# Altium project WUT-4-3-3.PrjPCB (part 1 of 2)
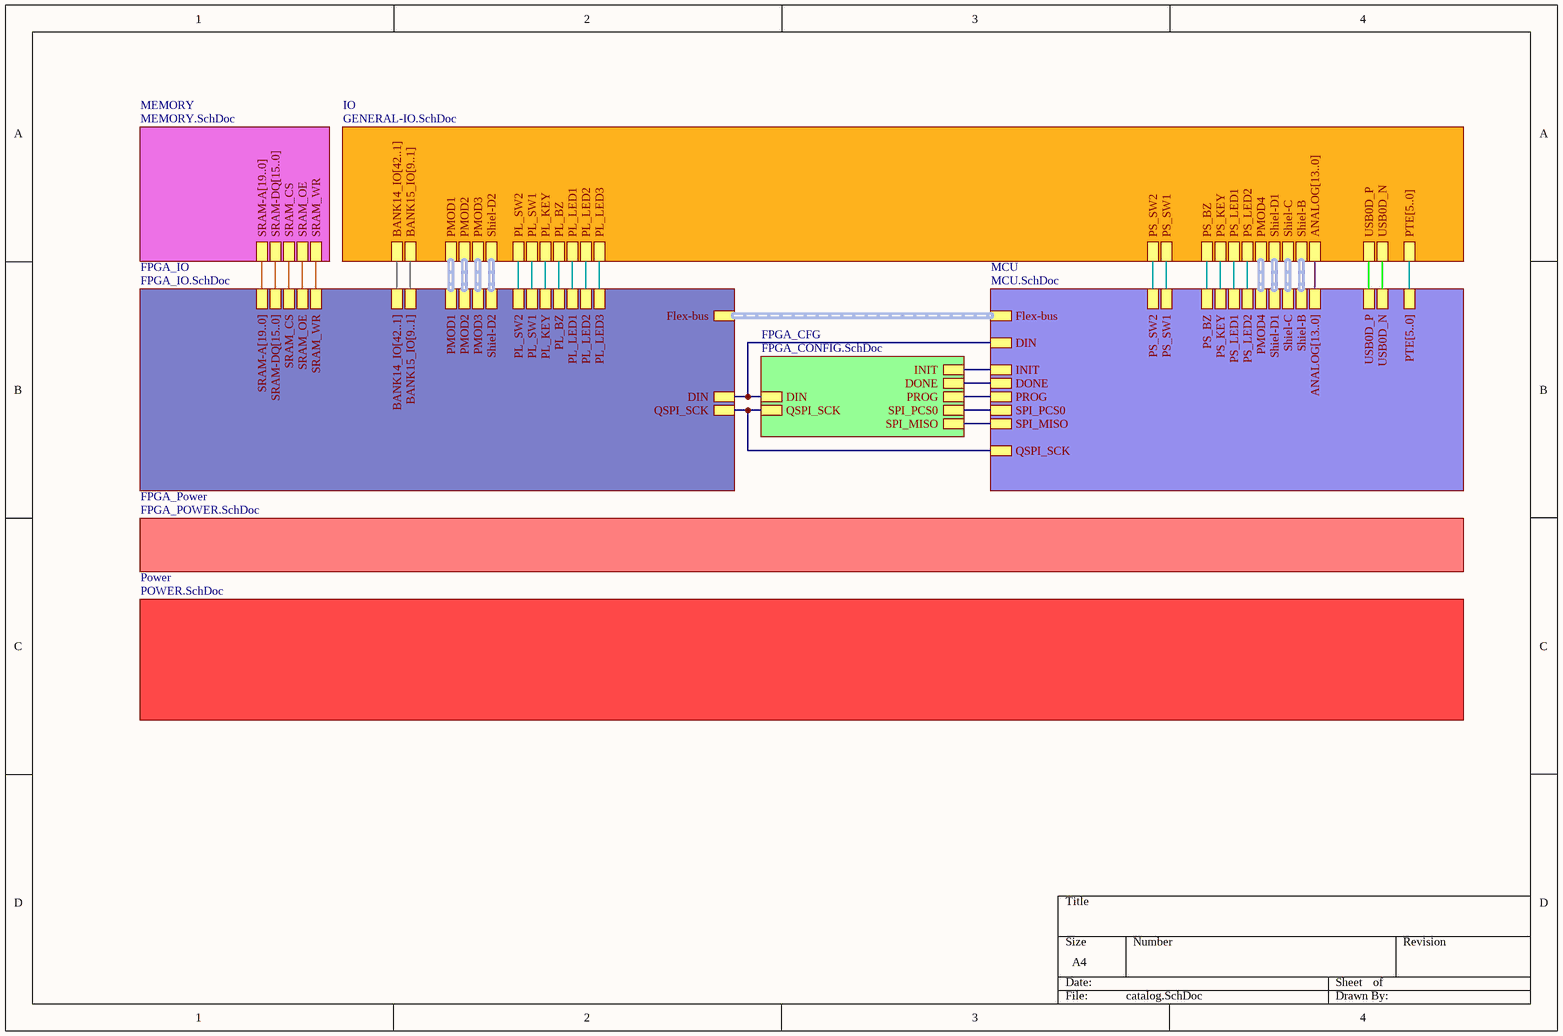
[diagram p0: catalog.SchDoc]
8 sheets, 240 parts. Net scope: hierarchical (ports join the sheet entries above them; power ports are global).
Board file: WUT-4-3-3.PcbDoc
Sheets:
  catalog.SchDoc
    FPGA_IO = FPGA_IO.SchDoc
    Power = POWER.SchDoc
    IO = GENERAL-IO.SchDoc
    MEMORY = MEMORY.SchDoc
    FPGA_CFG = FPGA_CONFIG.SchDoc
    FPGA_Power = FPGA_POWER.SchDoc
    MCU = MCU.SchDoc

## Sheet catalog.SchDoc
size A4

### Sub-sheets
FPGA_CFG = FPGA_CONFIG.SchDoc: QSPI_SCK, DIN, INIT, DONE, PROG, SPI_PCS0, SPI_MISO
FPGA_IO = FPGA_IO.SchDoc: QSPI_SCK, BANK14_IO[42..1], BANK15_IO[9..1], DIN, Flex-bus (harness Flexbus), SRAM-A[19..0] (harness Flexbus), SRAM-DQ[15..0] (harness Flexbus), SRAM_CS, SRAM_OE, SRAM_WR, Shiel-D2 (harness ShielD2), PL_SW2, PL_SW1, PL_KEY, PL_LED1, PL_LED2, PL_LED3, PMOD1 (harness PMOD), PMOD2 (harness PMOD), PMOD3 (harness PMOD), PL_BZ
FPGA_Power = FPGA_POWER.SchDoc: no entries
IO = GENERAL-IO.SchDoc: BANK14_IO[42..1], BANK15_IO[9..1], PTE[5..0] (harness Flexbus), USB0D_P, USB0D_N, ANALOG[13..0], Shiel-B (harness ShielB), PMOD4 (harness PMOD), Shiel-C (harness ShielC), Shiel-D1 (harness ShielD1), Shiel-D2 (harness ShielD2), PS_LED2, PS_LED1, PL_SW2, PL_SW1, PL_KEY, PS_KEY, PS_SW1, PS_SW2, PL_LED1, PL_LED2, PL_LED3, PMOD1 (harness PMOD), PMOD2 (harness PMOD), PMOD3 (harness PMOD), PL_BZ, PS_BZ
MCU = MCU.SchDoc: Flex-bus (harness Flexbus), PTE[5..0] (harness Flexbus), USB0D_N, USB0D_P, ANALOG[13..0], Shiel-B (harness ShielB), PMOD4 (harness PMOD), Shiel-C (harness ShielC), Shiel-D1 (harness ShielD1), DIN, INIT, DONE, PROG, SPI_PCS0, SPI_MISO, QSPI_SCK, PS_LED2, PS_LED1, PS_KEY, PS_SW1, PS_SW2, PS_BZ
MEMORY = MEMORY.SchDoc: SRAM-A[19..0] (harness Flexbus), SRAM-DQ[15..0] (harness Flexbus), SRAM_CS, SRAM_OE, SRAM_WR
Power = POWER.SchDoc: no entries

### Nets
BANK14_IO1: sheet FPGA_IO/PL_KEY, sheet IO/PL_KEY
BANK14_IO2: sheet FPGA_IO/PL_LED3, sheet IO/PL_LED3
BANK14_IO4: sheet FPGA_IO/PL_LED1, sheet IO/PL_LED1
BANK14_IO5: sheet FPGA_IO/PL_LED2, sheet IO/PL_LED2
BANK14_IO6: sheet FPGA_IO/PL_BZ, sheet IO/PL_BZ
BANK34_IO13: sheet FPGA_IO/PL_SW1, sheet IO/PL_SW1
BANK34_IO20: sheet FPGA_IO/PL_SW2, sheet IO/PL_SW2
DIN: sheet FPGA_IO/DIN, sheet FPGA_CFG/DIN, sheet MCU/DIN
DONE: sheet FPGA_CFG/DONE, sheet MCU/DONE
FPGA_INIT: sheet FPGA_CFG/INIT, sheet MCU/INIT
PROG: sheet FPGA_CFG/PROG, sheet MCU/PROG
PTA6: sheet IO/PS_SW1, sheet MCU/PS_SW1
PTA7: sheet IO/PS_SW2, sheet MCU/PS_SW2
PTD8: sheet IO/PS_LED1, sheet MCU/PS_LED1
PTD9: sheet IO/PS_LED2, sheet MCU/PS_LED2
PTE26: sheet IO/PS_BZ, sheet MCU/PS_BZ
PTE27: sheet IO/PS_KEY, sheet MCU/PS_KEY
QSPI_SCK: sheet FPGA_IO/QSPI_SCK, sheet FPGA_CFG/QSPI_SCK, sheet MCU/QSPI_SCK
SPI2_PCS0: sheet FPGA_CFG/SPI_PCS0, sheet MCU/SPI_PCS0
SPI2_SIN: sheet FPGA_CFG/SPI_MISO, sheet MCU/SPI_MISO
SRAM_CS: sheet FPGA_IO/SRAM_CS, sheet MEMORY/SRAM_CS
SRAM_OE: sheet FPGA_IO/SRAM_OE, sheet MEMORY/SRAM_OE
SRAM_WR: sheet FPGA_IO/SRAM_WR, sheet MEMORY/SRAM_WR
USB0D_N: sheet IO/USB0D_N, sheet MCU/USB0D_N
USB0D_P: sheet IO/USB0D_P, sheet MCU/USB0D_P

### Buses and harness runs
bus sheet FPGA_IO/BANK14_IO[42..1] = sheet IO/BANK14_IO[42..1]
bus sheet FPGA_IO/BANK15_IO[9..1] = sheet IO/BANK15_IO[9..1]
bus sheet IO/ANALOG[13..0] = sheet MCU/ANALOG[13..0]
harness sheet FPGA_IO/Flex-bus = sheet MCU/Flex-bus
harness sheet FPGA_IO/PMOD1 = sheet IO/PMOD1
harness sheet FPGA_IO/PMOD2 = sheet IO/PMOD2
harness sheet FPGA_IO/PMOD3 = sheet IO/PMOD3
harness sheet FPGA_IO/Shiel-D2 = sheet IO/Shiel-D2
harness sheet IO/PMOD4 = sheet MCU/PMOD4
harness sheet IO/Shiel-B = sheet MCU/Shiel-B
harness sheet IO/Shiel-C = sheet MCU/Shiel-C
harness sheet IO/Shiel-D1 = sheet MCU/Shiel-D1

## Sheet FPGA_IO.SchDoc
size A3
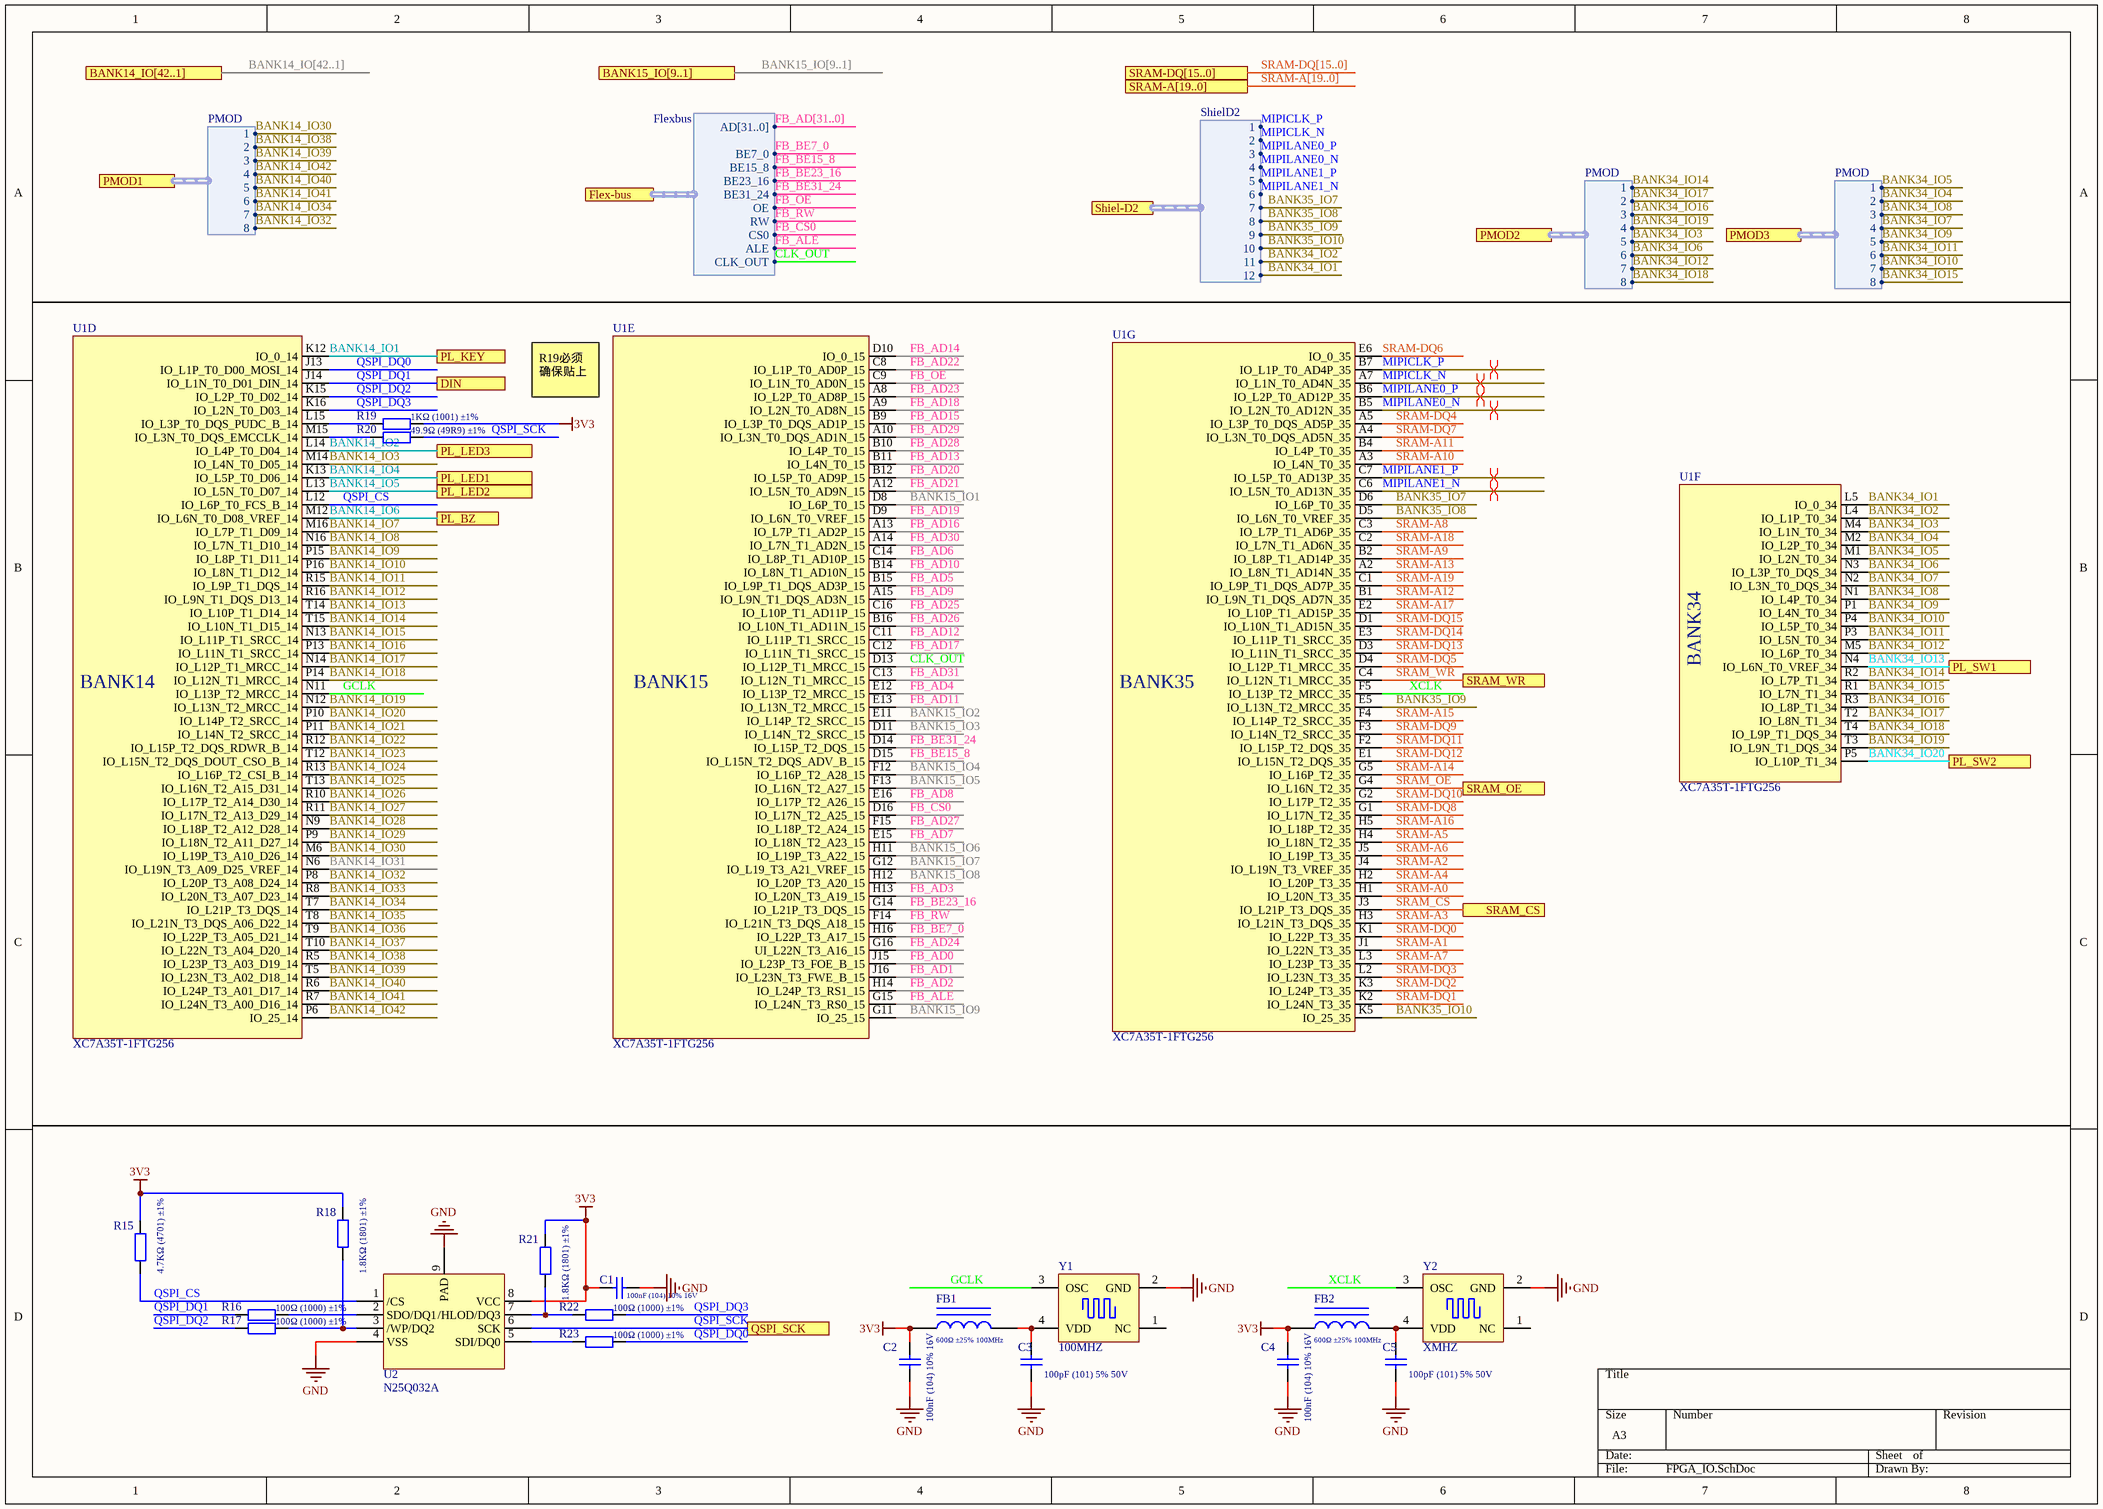
[diagram p1: FPGA_IO.SchDoc]

### Parts
C1  100nF (104) 10% 16V  [0402_C]
C2  100nF (104) 10% 16V  [0402_C]
C3  100pF (101) 5% 50V  [0402_C]
C4  100nF (104) 10% 16V  [0402_C]
C5  100pF (101) 5% 50V  [0402_C]
FB1  600Ω ±25% 100MHz  [0805_L]
FB2  600Ω ±25% 100MHz  [0805_L]
R15  4.7KΩ (4701) ±1%  [0402_R]
R16  100Ω (1000) ±1%  [0402_R]
R17  100Ω (1000) ±1%  [0402_R]
R18  1.8KΩ (1801) ±1%  [0603_R]
R19  1KΩ (1001) ±1%  [0402_R]
R20  49.9Ω (49R9) ±1%  [0402_R]
R21  1.8KΩ (1801) ±1%  [0603_R]
R22  100Ω (1000) ±1%  [0402_R]
R23  100Ω (1000) ±1%  [0402_R]
U1  XC7A35T-1FTG256  [BGA100P9X9-81A]  (parts D,E,F,G of 7)
U2  N25Q032A  [QFN127P500X600X100_HS-9N]
Y1  100MHZ  [XTAL7_3225]
Y2  XMHZ  [XTAL7_3225]

### Ports
BANK14_IO[42..1], BANK15_IO[9..1], DIN, Flex-bus (harness Flexbus), PL_BZ, PL_KEY, PL_LED1, PL_LED2, PL_LED3, PL_SW1, PL_SW2, PMOD1 (harness PMOD), PMOD2 (harness PMOD), PMOD3 (harness PMOD), QSPI_SCK, Shiel-D2 (harness ShielD2), SRAM-A[19..0], SRAM-DQ[15..0], SRAM_CS, SRAM_OE, SRAM_WR

### Harnesses
Flexbus: BE7_0, CS0, BE31_24, CLK_OUT, ALE, BE23_16, RW, BE15_8, OE, AD[31..0]
PMOD: 1, 2, 3, 4, 5, 6, 7, 8
ShielD2: 1, 2, 3, 4, 5, 6, 7, 8, 9, 10, 11, 12

### Nets
3V3: C1.1 C2.2 C4.2 FB1.1 FB2.1 R15.2 R18.2 R19.2 R21.2 U2.8(VCC)
GND: C1.2 C2.1 C3.1 C4.1 C5.1 U2.4(VSS) U2.9(PAD) Y1.2(GND) Y2.2(GND)
BANK14_IO1: U1.K12(IO_0_14) ; port PL_KEY
BANK14_IO2: U1.L14(IO_L4P_T0_D04_14) ; port PL_LED3
BANK14_IO3: U1.M14(IO_L4N_T0_D05_14)
BANK14_IO4: U1.K13(IO_L5P_T0_D06_14) ; port PL_LED1
BANK14_IO5: U1.L13(IO_L5N_T0_D07_14) ; port PL_LED2
BANK14_IO6: U1.M12(IO_L6N_T0_D08_VREF_14) ; port PL_BZ
BANK14_IO7: U1.M16(IO_L7P_T1_D09_14)
BANK14_IO8: U1.N16(IO_L7N_T1_D10_14)
BANK14_IO9: U1.P15(IO_L8P_T1_D11_14)
BANK14_IO10: U1.P16(IO_L8N_T1_D12_14)
BANK14_IO11: U1.R15(IO_L9P_T1_DQS_14)
BANK14_IO12: U1.R16(IO_L9N_T1_DQS_D13_14)
BANK14_IO13: U1.T14(IO_L10P_T1_D14_14)
BANK14_IO14: U1.T15(IO_L10N_T1_D15_14)
BANK14_IO15: U1.N13(IO_L11P_T1_SRCC_14)
BANK14_IO16: U1.P13(IO_L11N_T1_SRCC_14)
BANK14_IO17: U1.N14(IO_L12P_T1_MRCC_14)
BANK14_IO18: U1.P14(IO_L12N_T1_MRCC_14)
BANK14_IO19: U1.N12(IO_L13N_T2_MRCC_14)
BANK14_IO20: U1.P10(IO_L14P_T2_SRCC_14)
BANK14_IO21: U1.P11(IO_L14N_T2_SRCC_14)
BANK14_IO22: U1.R12(IO_L15P_T2_DQS_RDWR_B_14)
BANK14_IO23: U1.T12(IO_L15N_T2_DQS_DOUT_CSO_B_14)
BANK14_IO24: U1.R13(IO_L16P_T2_CSI_B_14)
BANK14_IO25: U1.T13(IO_L16N_T2_A15_D31_14)
BANK14_IO26: U1.R10(IO_L17P_T2_A14_D30_14)
BANK14_IO27: U1.R11(IO_L17N_T2_A13_D29_14)
BANK14_IO28: U1.N9(IO_L18P_T2_A12_D28_14)
BANK14_IO29: U1.P9(IO_L18N_T2_A11_D27_14)
BANK14_IO30: U1.M6(IO_L19P_T3_A10_D26_14) ; port PMOD1.1
BANK14_IO31: U1.N6(IO_L19N_T3_A09_D25_VREF_14)
BANK14_IO32: U1.P8(IO_L20P_T3_A08_D24_14) ; port PMOD1.8
BANK14_IO33: U1.R8(IO_L20N_T3_A07_D23_14)
BANK14_IO34: U1.T7(IO_L21P_T3_DQS_14) ; port PMOD1.7
BANK14_IO35: U1.T8(IO_L21N_T3_DQS_A06_D22_14)
BANK14_IO36: U1.T9(IO_L22P_T3_A05_D21_14)
BANK14_IO37: U1.T10(IO_L22N_T3_A04_D20_14)
BANK14_IO38: U1.R5(IO_L23P_T3_A03_D19_14) ; port PMOD1.2
BANK14_IO39: U1.T5(IO_L23N_T3_A02_D18_14) ; port PMOD1.3
BANK14_IO40: U1.R6(IO_L24P_T3_A01_D17_14) ; port PMOD1.5
BANK14_IO41: U1.R7(IO_L24N_T3_A00_D16_14) ; port PMOD1.6
BANK14_IO42: U1.P6(IO_25_14) ; port PMOD1.4
BANK15_IO1: U1.D8(IO_L6P_T0_15)
BANK15_IO2: U1.E11(IO_L14P_T2_SRCC_15)
BANK15_IO3: U1.D11(IO_L14N_T2_SRCC_15)
BANK15_IO4: U1.F12(IO_L16P_T2_A28_15)
BANK15_IO5: U1.F13(IO_L16N_T2_A27_15)
BANK15_IO6: U1.H11(IO_L19P_T3_A22_15)
BANK15_IO7: U1.G12(IO_L19_T3_A21_VREF_15)
BANK15_IO8: U1.H12(IO_L20P_T3_A20_15)
BANK15_IO9: U1.G11(IO_25_15)
BANK34_IO1: U1.L5(IO_0_34) ; port Shiel-D2.12
BANK34_IO2: U1.L4(IO_L1P_T0_34) ; port Shiel-D2.11
BANK34_IO3: U1.M4(IO_L1N_T0_34) ; port PMOD2.5
BANK34_IO4: U1.M2(IO_L2P_T0_34) ; port PMOD3.2
BANK34_IO5: U1.M1(IO_L2N_T0_34) ; port PMOD3.1
BANK34_IO6: U1.N3(IO_L3P_T0_DQS_34) ; port PMOD2.6
BANK34_IO7: U1.N2(IO_L3N_T0_DQS_34) ; port PMOD3.4
BANK34_IO8: U1.N1(IO_L4P_T0_34) ; port PMOD3.3
BANK34_IO9: U1.P1(IO_L4N_T0_34) ; port PMOD3.5
BANK34_IO10: U1.P4(IO_L5P_T0_34) ; port PMOD3.7
BANK34_IO11: U1.P3(IO_L5N_T0_34) ; port PMOD3.6
BANK34_IO12: U1.M5(IO_L6P_T0_34) ; port PMOD2.7
BANK34_IO13: U1.N4(IO_L6N_T0_VREF_34) ; port PL_SW1
BANK34_IO14: U1.R2(IO_L7P_T1_34) ; port PMOD2.1
BANK34_IO15: U1.R1(IO_L7N_T1_34) ; port PMOD3.8
BANK34_IO16: U1.R3(IO_L8P_T1_34) ; port PMOD2.3
BANK34_IO17: U1.T2(IO_L8N_T1_34) ; port PMOD2.2
BANK34_IO18: U1.T4(IO_L9P_T1_DQS_34) ; port PMOD2.8
BANK34_IO19: U1.T3(IO_L9N_T1_DQS_34) ; port PMOD2.4
BANK34_IO20: U1.P5(IO_L10P_T1_34) ; port PL_SW2
BANK35_IO7: U1.D6(IO_L6P_T0_35) ; port Shiel-D2.7
BANK35_IO8: U1.D5(IO_L6N_T0_VREF_35) ; port Shiel-D2.8
BANK35_IO9: U1.E5(IO_L13N_T2_MRCC_35) ; port Shiel-D2.9
BANK35_IO10: U1.K5(IO_25_35) ; port Shiel-D2.10
CLK_OUT: U1.D13(IO_L12P_T1_MRCC_15) ; port Flex-bus.CLK_OUT
FB_AD0: U1.J15(IO_L23P_T3_FOE_B_15)
FB_AD1: U1.J16(IO_L23N_T3_FWE_B_15)
FB_AD2: U1.H14(IO_L24P_T3_RS1_15)
FB_AD3: U1.H13(IO_L20N_T3_A19_15)
FB_AD4: U1.E12(IO_L13P_T2_MRCC_15)
FB_AD5: U1.B15(IO_L9P_T1_DQS_AD3P_15)
FB_AD6: U1.C14(IO_L8P_T1_AD10P_15)
FB_AD7: U1.E15(IO_L18N_T2_A23_15)
FB_AD8: U1.E16(IO_L17P_T2_A26_15)
FB_AD9: U1.A15(IO_L9N_T1_DQS_AD3N_15)
FB_AD10: U1.B14(IO_L8N_T1_AD10N_15)
FB_AD11: U1.E13(IO_L13N_T2_MRCC_15)
FB_AD12: U1.C11(IO_L11P_T1_SRCC_15)
FB_AD13: U1.B11(IO_L4N_T0_15)
FB_AD14: U1.D10(IO_0_15)
FB_AD15: U1.B9(IO_L3P_T0_DQS_AD1P_15)
FB_AD16: U1.A13(IO_L7P_T1_AD2P_15)
FB_AD17: U1.C12(IO_L11N_T1_SRCC_15)
FB_AD18: U1.A9(IO_L2N_T0_AD8N_15)
FB_AD19: U1.D9(IO_L6N_T0_VREF_15)
FB_AD20: U1.B12(IO_L5P_T0_AD9P_15)
FB_AD21: U1.A12(IO_L5N_T0_AD9N_15)
FB_AD22: U1.C8(IO_L1P_T0_AD0P_15)
FB_AD23: U1.A8(IO_L2P_T0_AD8P_15)
FB_AD24: U1.G16(UI_L22N_T3_A16_15)
FB_AD25: U1.C16(IO_L10P_T1_AD11P_15)
FB_AD26: U1.B16(IO_L10N_T1_AD11N_15)
FB_AD27: U1.F15(IO_L18P_T2_A24_15)
FB_AD28: U1.B10(IO_L4P_T0_15)
FB_AD29: U1.A10(IO_L3N_T0_DQS_AD1N_15)
FB_AD30: U1.A14(IO_L7N_T1_AD2N_15)
FB_AD31: U1.C13(IO_L12N_T1_MRCC_15)
FB_ALE: U1.G15(IO_L24N_T3_RS0_15) ; port Flex-bus.ALE
FB_BE7_0: U1.H16(IO_L22P_T3_A17_15) ; port Flex-bus.BE7_0
FB_BE15_8: U1.D15(IO_L15N_T2_DQS_ADV_B_15) ; port Flex-bus.BE15_8
FB_BE23_16: U1.G14(IO_L21P_T3_DQS_15) ; port Flex-bus.BE23_16
FB_BE31_24: U1.D14(IO_L15P_T2_DQS_15) ; port Flex-bus.BE31_24
FB_CS0: U1.D16(IO_L17N_T2_A25_15) ; port Flex-bus.CS0
FB_OE: U1.C9(IO_L1N_T0_AD0N_15) ; port Flex-bus.OE
FB_RW: U1.F14(IO_L21N_T3_DQS_A18_15) ; port Flex-bus.RW
GCLK: U1.N11(IO_L13P_T2_MRCC_14) Y1.3(OSC)
MIPICLK_N: U1.A7(IO_L1N_T0_AD4N_35) ; port Shiel-D2.2
MIPICLK_P: U1.B7(IO_L1P_T0_AD4P_35) ; port Shiel-D2.1
MIPILANE0_N: U1.B5(IO_L2N_T0_AD12N_35) ; port Shiel-D2.4
MIPILANE0_P: U1.B6(IO_L2P_T0_AD12P_35) ; port Shiel-D2.3
MIPILANE1_N: U1.C6(IO_L5N_T0_AD13N_35) ; port Shiel-D2.6
MIPILANE1_P: U1.C7(IO_L5P_T0_AD13P_35) ; port Shiel-D2.5
QSPI_CS: R15.1 U1.L12(IO_L6P_T0_FCS_B_14) U2.1(/CS)
QSPI_DQ0: R23.2 U1.J13(IO_L1P_T0_D00_MOSI_14)
QSPI_DQ1: R16.1 U1.J14(IO_L1N_T0_D01_DIN_14) ; port DIN  [project net DIN]
QSPI_DQ2: R17.1 U1.K15(IO_L2P_T0_D02_14)
QSPI_DQ3: R22.2 U1.K16(IO_L2N_T0_D03_14)
QSPI_SCK: R20.2 U2.6(SCK) ; port QSPI_SCK
SRAM-A0: U1.H1(IO_L20N_T3_35)
SRAM-A1: U1.J1(IO_L22N_T3_35)
SRAM-A2: U1.J4(IO_L19N_T3_VREF_35)
SRAM-A3: U1.H3(IO_L21N_T3_DQS_35)
SRAM-A4: U1.H2(IO_L20P_T3_35)
SRAM-A5: U1.H4(IO_L18N_T2_35)
SRAM-A6: U1.J5(IO_L19P_T3_35)
SRAM-A7: U1.L3(IO_L23P_T3_35)
SRAM-A8: U1.C3(IO_L7P_T1_AD6P_35)
SRAM-A9: U1.B2(IO_L8P_T1_AD14P_35)
SRAM-A10: U1.A3(IO_L4N_T0_35)
SRAM-A11: U1.B4(IO_L4P_T0_35)
SRAM-A12: U1.B1(IO_L9N_T1_DQS_AD7N_35)
SRAM-A13: U1.A2(IO_L8N_T1_AD14N_35)
SRAM-A14: U1.G5(IO_L16P_T2_35)
SRAM-A15: U1.F4(IO_L14P_T2_SRCC_35)
SRAM-A16: U1.H5(IO_L18P_T2_35)
SRAM-A17: U1.E2(IO_L10P_T1_AD15P_35)
SRAM-A18: U1.C2(IO_L7N_T1_AD6N_35)
SRAM-A19: U1.C1(IO_L9P_T1_DQS_AD7P_35)
SRAM-DQ0: U1.K1(IO_L22P_T3_35)
SRAM-DQ1: U1.K2(IO_L24N_T3_35)
SRAM-DQ2: U1.K3(IO_L24P_T3_35)
SRAM-DQ3: U1.L2(IO_L23N_T3_35)
SRAM-DQ4: U1.A5(IO_L3P_T0_DQS_AD5P_35)
SRAM-DQ5: U1.D4(IO_L12P_T1_MRCC_35)
SRAM-DQ6: U1.E6(IO_0_35)
SRAM-DQ7: U1.A4(IO_L3N_T0_DQS_AD5N_35)
SRAM-DQ8: U1.G1(IO_L17N_T2_35)
SRAM-DQ9: U1.F3(IO_L14N_T2_SRCC_35)
SRAM-DQ10: U1.G2(IO_L17P_T2_35)
SRAM-DQ11: U1.F2(IO_L15P_T2_DQS_35)
SRAM-DQ12: U1.E1(IO_L15N_T2_DQS_35)
SRAM-DQ13: U1.D3(IO_L11N_T1_SRCC_35)
SRAM-DQ14: U1.E3(IO_L11P_T1_SRCC_35)
SRAM-DQ15: U1.D1(IO_L10N_T1_AD15N_35)
SRAM_CS: U1.J3(IO_L21P_T3_DQS_35) ; port SRAM_CS
SRAM_OE: U1.G4(IO_L16N_T2_35) ; port SRAM_OE
SRAM_WR: U1.C4(IO_L12N_T1_MRCC_35) ; port SRAM_WR
XCLK: U1.F5(IO_L13P_T2_MRCC_35) Y2.3(OSC)
NetC3_2: C3.2 FB1.2 Y1.4(VDD)
NetC5_2: C5.2 FB2.2 Y2.4(VDD)
NetR16_2: R16.2 U2.2(SDO/DQ1)
NetR17_2: R17.2 R18.1 U2.3(/WP/DQ2)
NetR19_1: R19.1 U1.L15(IO_L3P_T0_DQS_PUDC_B_14)
NetR20_1: R20.1 U1.M15(IO_L3N_T0_DQS_EMCCLK_14)
NetR21_1: R21.1 R22.1 U2.7(/HLOD/DQ3)
NetR23_1: R23.1 U2.5(SDI/DQ0)

Not connected (* = marked no-connect by the designer): Y1 1(NC); Y2 1(NC)

### Buses and harness runs
bus BANK14_IO[42..1] = port BANK14_IO[42..1]
bus BANK15_IO[9..1] = port BANK15_IO[9..1]
bus FB_AD[31..0]
bus SRAM-A[19..0] = port SRAM-A[19..0]
bus SRAM-DQ[15..0] = port SRAM-DQ[15..0]

### Layout directives
differential pair: MIPICLK_N, MIPICLK_P, MIPILANE0_N, MIPILANE0_P, MIPILANE1_N, MIPILANE1_P

### Notes on the sheet
- R19必须确保贴上
- (in symbol XC7A35T-1FTG256, part D) BANK14
- (in symbol XC7A35T-1FTG256, part E) BANK15
- (in symbol XC7A35T-1FTG256, part F) BANK34
- (in symbol XC7A35T-1FTG256, part G) BANK35

### Library data of the parts
C1 C2 C4 = 0402 100nF (104) 10% 16V: 贴片电容; ComponentLink1Description: 供应商链接; ComponentLink1URL: http://www.szlcsc.com/product/details_1877.html; Package: 0402; Supplier: LC; SuppliersPartNumber: C1525
C3 C5 = 0402 100pF (101) 5% 50V: 贴片电容; ComponentLink1Description: 供应商链接; ComponentLink1URL: http://www.szlcsc.com/product/details_1898.html; Package: 0402; Supplier: LC; SuppliersPartNumber: C1546
FB1 FB2 = 0805 600Ω 25% 100MHz: 贴片磁珠; ComponentLink1Description: 供应商链接; ComponentLink1URL: http://www.szlcsc.com/product/details_1369.html; Package: 0805; Supplier: LC; SuppliersPartNumber: C1017
R15 = 0402 4.7KΩ (4701) 1%: 贴片电阻; ComponentLink1Description: 供应商链接; ComponentLink1URL: http://www.szlcsc.com/product/details_26643.html; Package: 0402; Supplier: LC; SuppliersPartNumber: C25900
R16 R17 R22 R23 = 0402 100Ω (1000) 1%: 贴片电阻; ComponentLink1Description: 供应商链接; ComponentLink1URL: http://www.szlcsc.com/product/details_25819.html; Package: 0402; Supplier: LC; SuppliersPartNumber: C25076
R18 R21 = 0603 1.8KΩ (1801) 1%: 贴片电阻; ComponentLink1Description: 供应商链接; ComponentLink1URL: http://www.szlcsc.com/product/details_4584.html; Package: 0603; Supplier: LC; SuppliersPartNumber: C4177
R19 = 0402 1KΩ (1001) 1%: 贴片电阻; ComponentLink1Description: 供应商链接; ComponentLink1URL: http://www.szlcsc.com/product/details_12256.html; Package: 0402; Supplier: LC; SuppliersPartNumber: C11702
R20 = 0402 49.9Ω (49R9) 1%: 贴片电阻; ComponentLink1Description: 供应商链接; ComponentLink1URL: http://www.szlcsc.com/product/details_25863.html; Package: 0402; Supplier: LC; SuppliersPartNumber: C25120
Y1 Y2 = XTAL1

## Sheet POWER.SchDoc
size A3
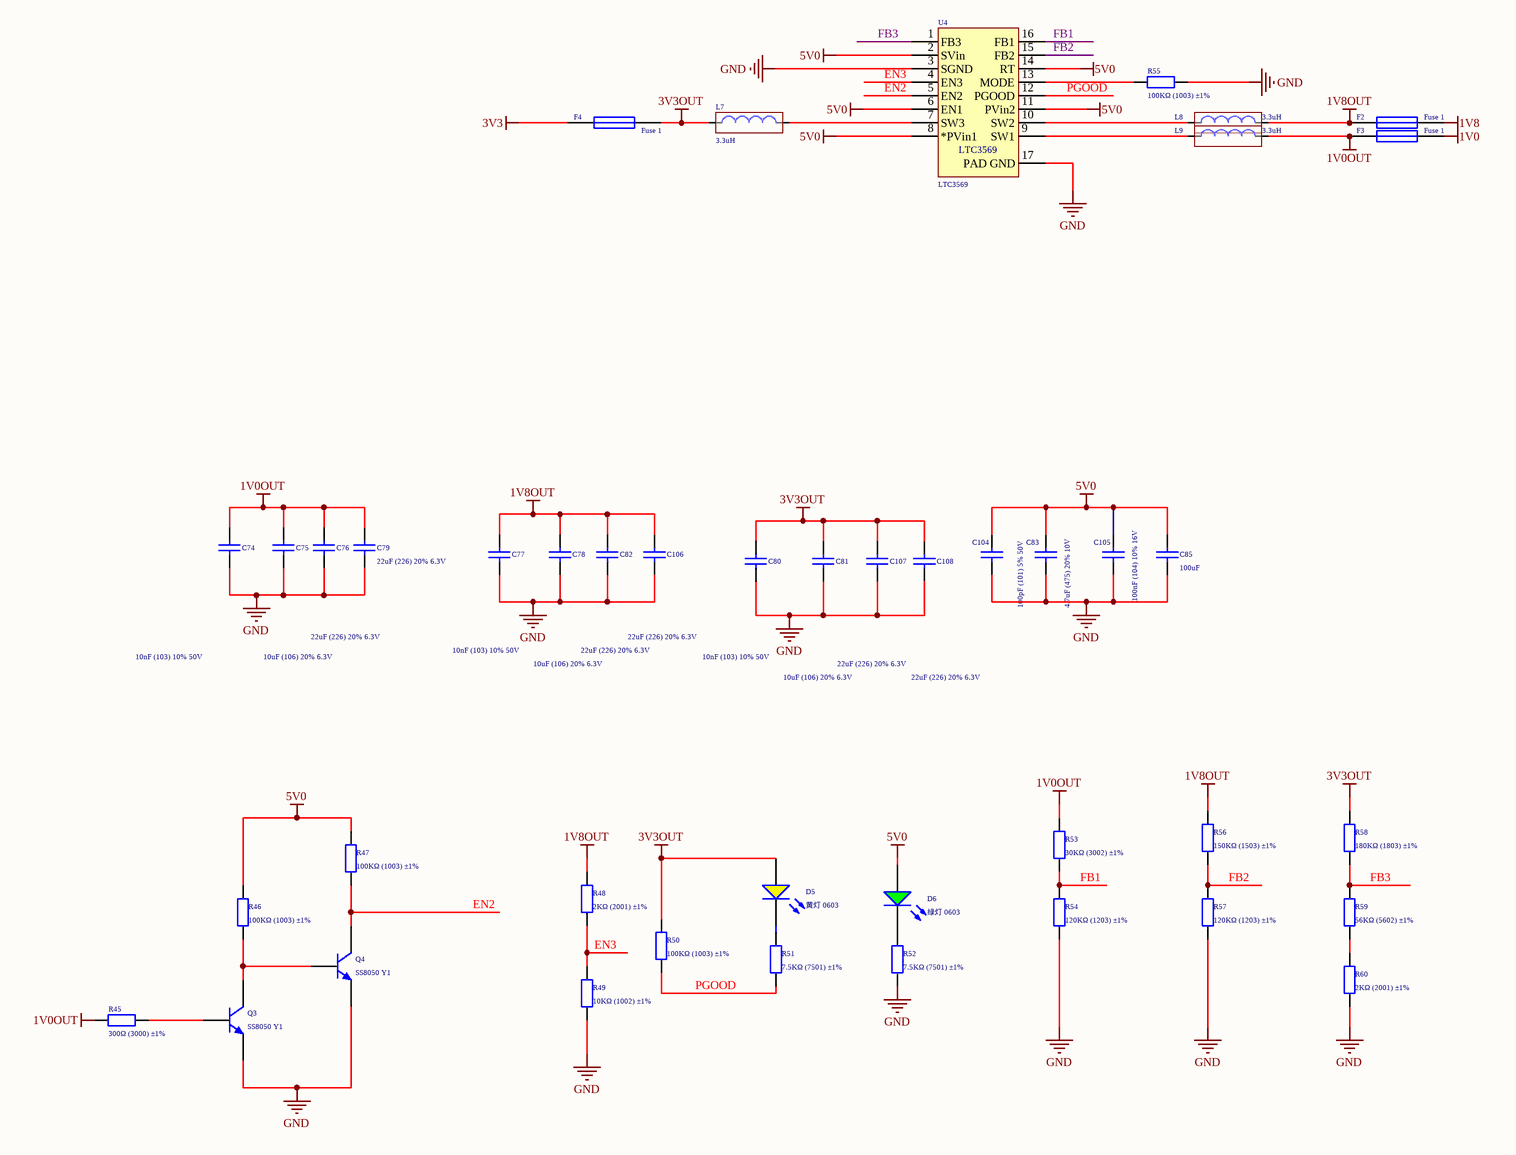
[diagram p2: POWER.SchDoc]

### Parts
C74  10nF (103) 10% 50V  [0402_C]
C75  10uF (106) 20% 6.3V  [0402_C]
C76  22uF (226) 20% 6.3V  [0603_C]
C77  10nF (103) 10% 50V  [0402_C]
C78  10uF (106) 20% 6.3V  [0402_C]
C79  22uF (226) 20% 6.3V  [0603_C]
C80  10nF (103) 10% 50V  [0402_C]
C81  10uF (106) 20% 6.3V  [0402_C]
C82  22uF (226) 20% 6.3V  [0603_C]
C83  4.7uF (475) 20% 10V  [0402_C]
C85  value 100uF  [LC-1206]  (hidden comment: Cap)
C104  100pF (101) 5% 50V  [0402_C]
C105  100nF (104) 10% 16V  [0402_C]
C106  22uF (226) 20% 6.3V  [0603_C]
C107  22uF (226) 20% 6.3V  [0603_C]
C108  22uF (226) 20% 6.3V  [0603_C]
D5  黄灯 0603  [0603_LED_S1]
D6  绿灯 0603  [0603_LED_S1]
F2  Fuse 1  [1206]
F3  Fuse 1  [1206]
F4  Fuse 1  [1206]
L7  3.3uH  [LC-1210]
L8  3.3uH  [LC-1210]
L9  3.3uH  [LC-1210]
Q3  SS8050 Y1  [SOT-23(SOT-23-3)]
Q4  SS8050 Y1  [SOT-23(SOT-23-3)]
R45  300Ω (3000) ±1%  [0402_R]
R46  100KΩ (1003) ±1%  [0402_R]
R47  100KΩ (1003) ±1%  [0402_R]
R48  2KΩ (2001) ±1%  [0402_R]
R49  10KΩ (1002) ±1%  [0402_R]
R50  100KΩ (1003) ±1%  [0402_R]
R51  7.5KΩ (7501) ±1%  [0402_R]
R52  7.5KΩ (7501) ±1%  [0402_R]
R53  30KΩ (3002) ±1%  [0603_R]
R54  120KΩ (1203) ±1%  [0402_R]
R55  100KΩ (1003) ±1%  [0402_R]
R56  150KΩ (1503) ±1%  [0402_R]
R57  120KΩ (1203) ±1%  [0402_R]
R58  180KΩ (1803) ±1%  [0603_R]
R59  56KΩ (5602) ±1%  [0402_R]
R60  2KΩ (2001) ±1%  [0402_R]
U4  LTC3569  [SOP127P600-16N]

### Nets
1V0: F3.1
1V0OUT: C74.2 C75.2 C76.2 C79.2 F3.2 L9.2 R45.1 R53.2
1V8: F2.1
1V8OUT: C77.2 C78.2 C82.2 C106.2 F2.2 L8.2 R48.2 R56.2
3V3: F4.2
3V3OUT: C80.2 C81.2 C107.2 C108.2 D5.A F4.1 L7.1 R50.2 R58.2
5V0: C83.1 C85.2 C104.2 C105.2 D6.A R46.2 R47.2 U4.2(SVin) U4.6(EN1) U4.8(*PVin1) U4.11(PVin2) U4.14(RT)
GND: C74.1 C75.1 C76.1 C77.1 C78.1 C79.1 C80.1 C81.1 C82.1 C83.2 C85.1 C104.1 C105.1 C106.1 C107.1 C108.1 Q3.2(E) Q4.2(E) R49.1 R52.1 R54.1 R55.2 R57.1 R60.1 U4.3(SGND) U4.17(PAD_GND)
EN2: Q4.3(C) R47.1 U4.5(EN2)
EN3: R48.1 R49.2 U4.4(EN3)
FB1: R53.1 R54.2 U4.16(FB1)
FB2: R56.1 R57.2 U4.15(FB2)
FB3: R58.1 R59.2 U4.1(FB3)
PGOOD: R50.1 R51.1 U4.12(PGOOD)
NetD5_K: D5.K R51.2
NetD6_K: D6.K R52.2
NetL7_2: L7.2 U4.7(SW3)
NetL8_1: L8.1 U4.10(SW2)
NetL9_1: L9.1 U4.9(SW1)
NetQ3_1: Q3.1(B) R45.2
NetQ3_3: Q3.3(C) Q4.1(B) R46.1
NetR55_1: R55.1 U4.13(MODE)
NetR59_1: R59.1 R60.2

### Library data of the parts
C74 C77 C80 = 0402 10nF (103) 10% 50V: 贴片电容; ComponentLink1Description: 供应商链接; ComponentLink1URL: http://www.szlcsc.com/product/details_15869.html; Package: 0402; Supplier: LC; SuppliersPartNumber: C15195
C75 C78 C81 = 0402 10uF (106) 20% 6.3V: 贴片电容; ComponentLink1Description: 供应商链接; ComponentLink1URL: http://www.szlcsc.com/product/details_16204.html; Package: 0402; Supplier: LC; SuppliersPartNumber: C15525
C76 C79 C82 C106-C108 = 0603 22uF (226) 20% 6.3V: 贴片电容; ComponentLink1Description: 供应商链接; ComponentLink1URL: http://www.szlcsc.com/product/details_60514.html; Package: 0603; Supplier: LC; SuppliersPartNumber: C59461
C83 = 0402 4.7uF (475) 20% 10V: 贴片电容; ComponentLink1Description: 供应商链接; ComponentLink1URL: http://www.szlcsc.com/product/details_24469.html; Package: 0402; Supplier: LC; SuppliersPartNumber: C23733
C85 = Cap: 贴片电容; Published: 8-Jun-2000; LatestRevisionDate: 17-Jul-2002; LatestRevisionNote: Re-released for DXP Platform.; PackageReference: RAD-0.3; Publisher: Altium Limited
C104 = 0402 100pF (101) 5% 50V: 贴片电容; ComponentLink1Description: 供应商链接; ComponentLink1URL: http://www.szlcsc.com/product/details_1898.html; Package: 0402; Supplier: LC; SuppliersPartNumber: C1546
C105 = 0402 100nF (104) 10% 16V: 贴片电容; ComponentLink1Description: 供应商链接; ComponentLink1URL: http://www.szlcsc.com/product/details_1877.html; Package: 0402; Supplier: LC; SuppliersPartNumber: C1525
D5 = 0603 黄灯: 发光二极管; ComponentLink1Description: 供应商链接; ComponentLink1URL: http://www.szlcsc.com/product/details_73147.html; Package: 0603; Supplier: LC; SuppliersPartNumber: C72038
D6 = 0603 绿灯: 发光二极管; ComponentLink1Description: 供应商链接; ComponentLink1URL: http://www.szlcsc.com/product/details_73152.html; Package: 0603; Supplier: LC; SuppliersPartNumber: C72043
F2-F4 = Fuse 1: Fuse; Published: 8-Jun-2000; LatestRevisionDate: 17-Jul-2002; LatestRevisionNote: Re-released for DXP Platform.; PackageReference: PIN-W2/E2.8; Publisher: Altium Limited; PackageDescription: Thru-Hole; 2 Leads
L7-L9 = Inductor_1: Inductor
Q3 Q4 = SOT-23 SS8050 Y1: 三极管; ComponentLink1Description: 供应商链接; ComponentLink1URL: http://www.szlcsc.com/product/details_2507.html; Package: SOT-23; Supplier: LC; SuppliersPartNumber: C2150
R45 = 0402 300Ω (3000) 1%: 贴片电阻; ComponentLink1Description: 供应商链接; ComponentLink1URL: http://www.szlcsc.com/product/details_25845.html; Package: 0402; Supplier: LC; SuppliersPartNumber: C25102
R46 R47 R50 R55 = 0402 100KΩ (1003) 1%: 贴片电阻; ComponentLink1Description: 供应商链接; ComponentLink1URL: http://www.szlcsc.com/product/details_26484.html; Package: 0402; Supplier: LC; SuppliersPartNumber: C25741
R48 R60 = 0402 2KΩ (2001) 1%: 贴片电阻; ComponentLink1Description: 供应商链接; ComponentLink1URL: http://www.szlcsc.com/product/details_4516.html; Package: 0402; Supplier: LC; SuppliersPartNumber: C4109
R49 = 0402 10KΩ (1002) 1%: 贴片电阻; ComponentLink1Description: 供应商链接; ComponentLink1URL: http://www.szlcsc.com/product/details_26487.html; Package: 0402; Supplier: LC; SuppliersPartNumber: C25744
R51 R52 = 0402 7.5KΩ (7501) 1%: 贴片电阻; ComponentLink1Description: 供应商链接; ComponentLink1URL: http://www.szlcsc.com/product/details_26661.html; Package: 0402; Supplier: LC; SuppliersPartNumber: C25918
R53 = 0603 30KΩ (3002) 1%: 贴片电阻; ComponentLink1Description: 供应商链接; ComponentLink1URL: http://www.szlcsc.com/product/details_23711.html; Package: 0603; Supplier: LC; SuppliersPartNumber: C22984
R54 R57 = 0402 120KΩ (1203) 1%: 贴片电阻; ComponentLink1Description: 供应商链接; ComponentLink1URL: http://www.szlcsc.com/product/details_26493.html; Package: 0402; Supplier: LC; SuppliersPartNumber: C25750
R56 = 0402 150KΩ (1503) 1%: 贴片电阻; ComponentLink1Description: 供应商链接; ComponentLink1URL: http://www.szlcsc.com/product/details_26498.html; Package: 0402; Supplier: LC; SuppliersPartNumber: C25755
R58 = 0603 180KΩ (1803) 1%: 贴片电阻; ComponentLink1Description: 供应商链接; ComponentLink1URL: http://www.szlcsc.com/product/details_23554.html; Package: 0603; Supplier: LC; SuppliersPartNumber: C22827
R59 = 0402 56KΩ (5602) 1%: 贴片电阻; ComponentLink1Description: 供应商链接; ComponentLink1URL: http://www.szlcsc.com/product/details_26539.html; Package: 0402; Supplier: LC; SuppliersPartNumber: C25796

## Sheet GENERAL-IO.SchDoc
size A3
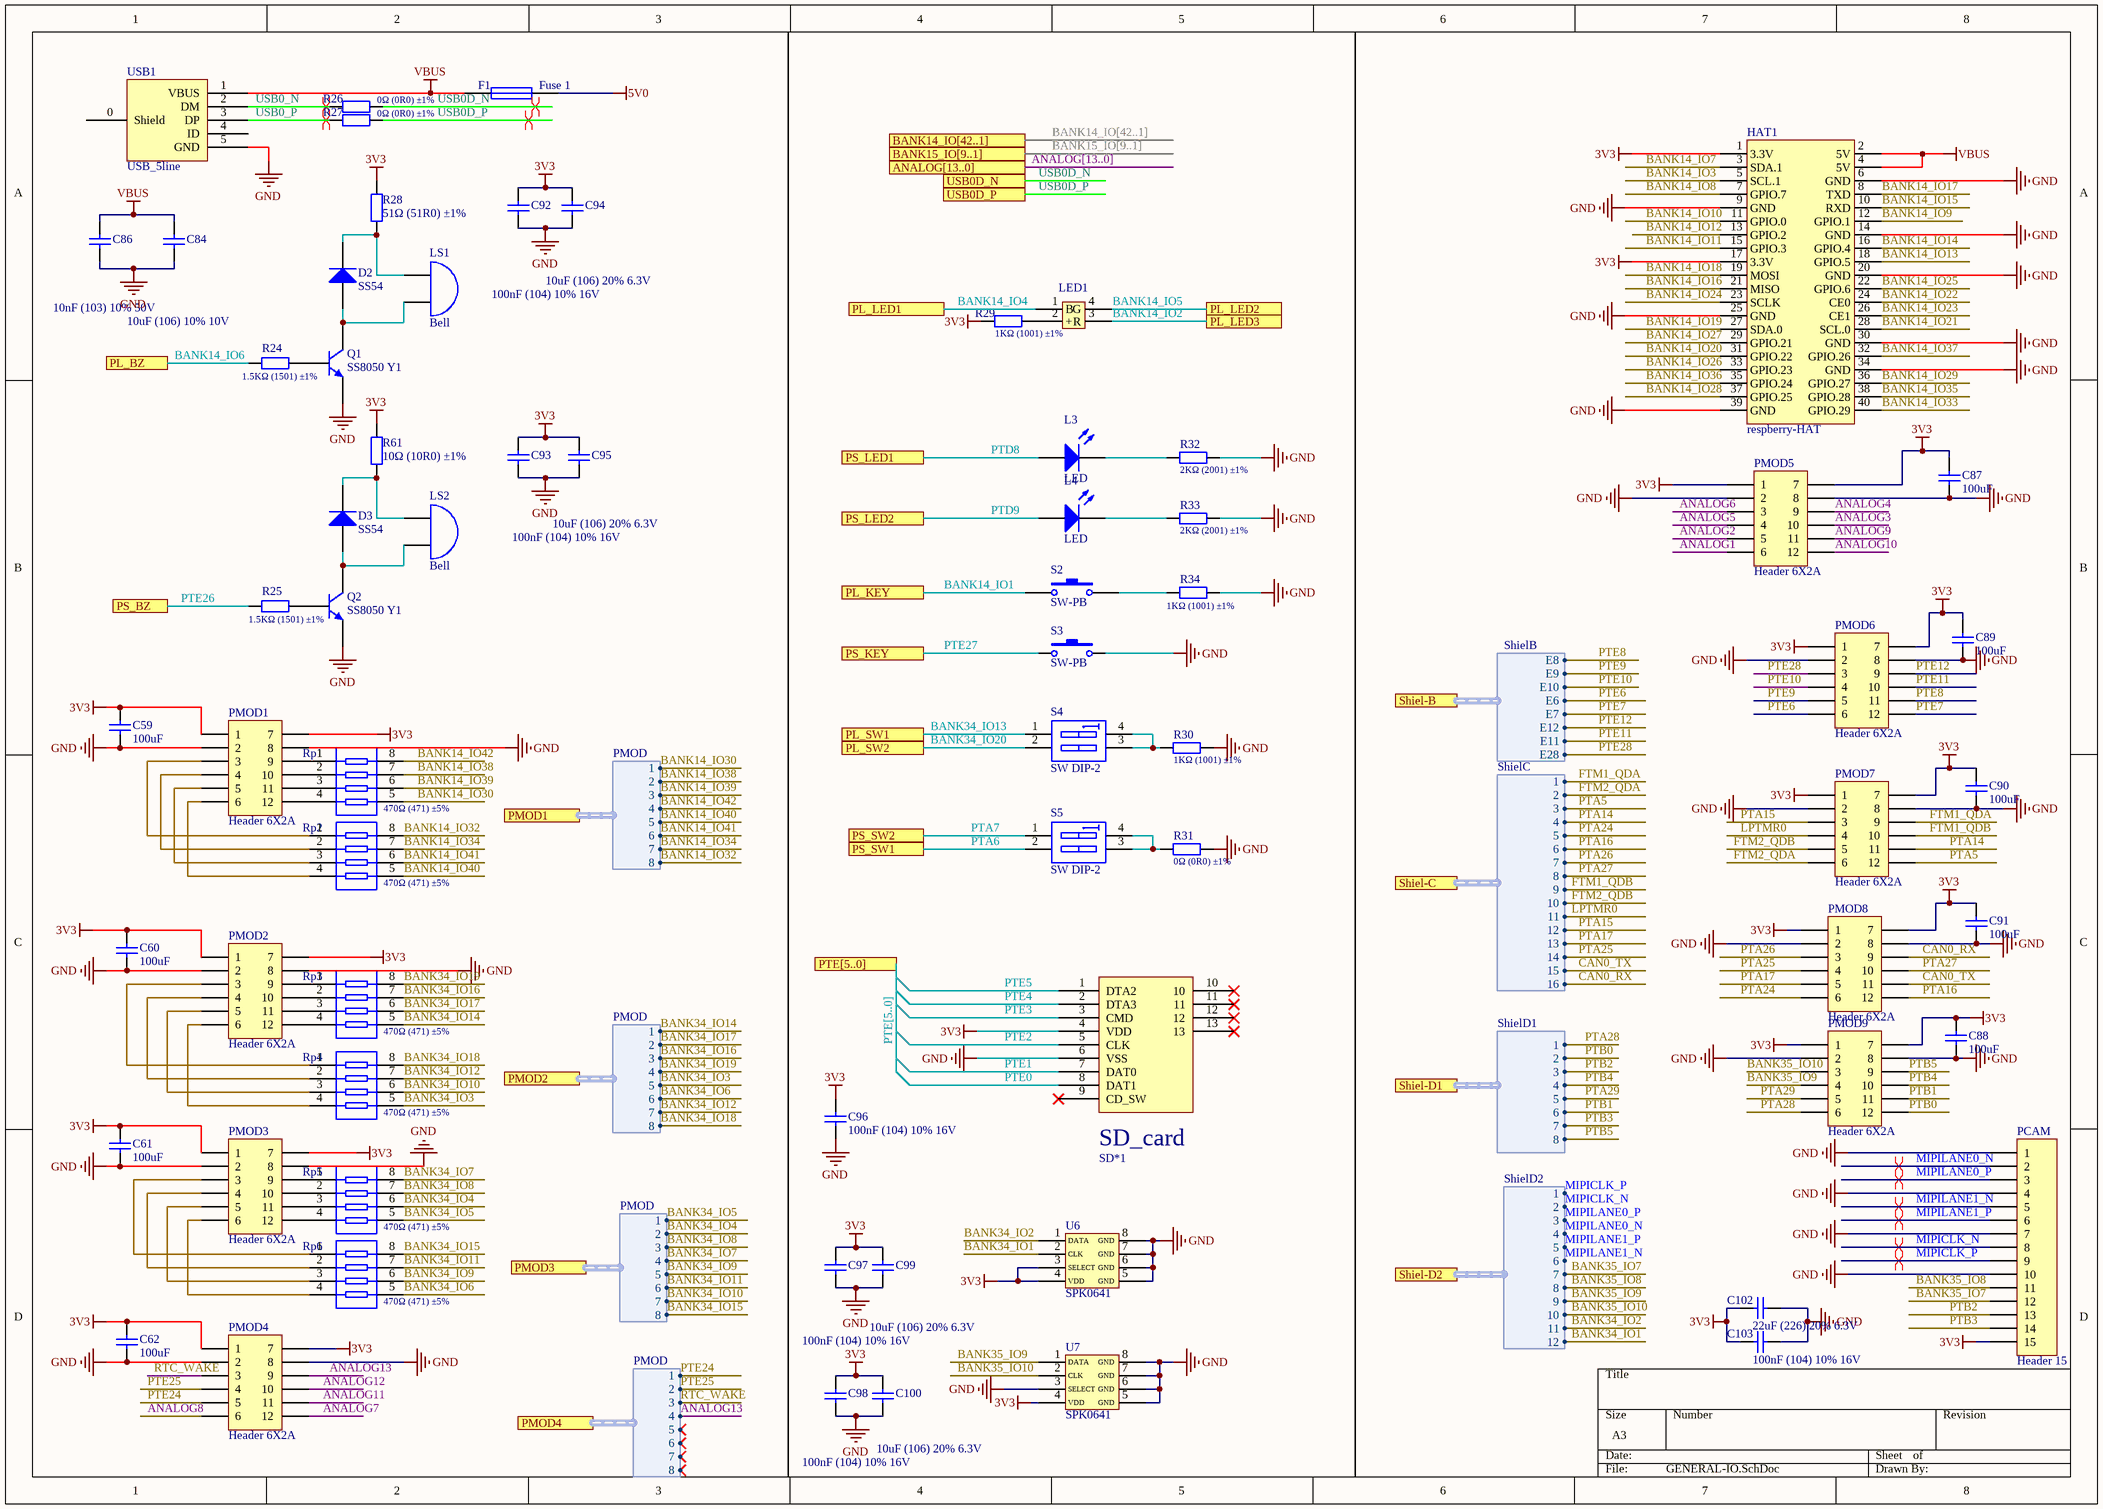
[diagram p3: GENERAL-IO.SchDoc]

### Parts
C59  value 100uF  [LC-1206]  (hidden comment: Cap)
C60  value 100uF  [LC-1206]  (hidden comment: Cap)
C61  value 100uF  [LC-1206]  (hidden comment: Cap)
C62  value 100uF  [LC-1206]  (hidden comment: Cap)
C84  10uF (106) 10% 10V  [0603_C]
C86  10nF (103) 10% 50V  [0402_C]
C87  value 100uF  [LC-1206]  (hidden comment: Cap)
C88  value 100uF  [LC-1206]  (hidden comment: Cap)
C89  value 100uF  [LC-1206]  (hidden comment: Cap)
C90  value 100uF  [LC-1206]  (hidden comment: Cap)
C91  value 100uF  [LC-1206]  (hidden comment: Cap)
C92  100nF (104) 10% 16V  [0402_C]
C93  100nF (104) 10% 16V  [0402_C]
C94  10uF (106) 20% 6.3V  [0402_C]
C95  10uF (106) 20% 6.3V  [0402_C]
C96  100nF (104) 10% 16V  [0402_C]
C97  100nF (104) 10% 16V  [0402_C]
C98  100nF (104) 10% 16V  [0402_C]
C99  10uF (106) 20% 6.3V  [0402_C]
C100  10uF (106) 20% 6.3V  [0402_C]
C102  22uF (226) 20% 6.3V  [0603_C]
C103  100nF (104) 10% 16V  [0402_C]
D2  SS54  [SMA(DO-214AC)_S1]
D3  SS54  [SMA(DO-214AC)_S1]
F1  Fuse 1  [1206]
HAT1  respberry-HAT  [RESPBERRY-HAT]
L3  LED  [1608[0603]]
L4  LED  [1608[0603]]
LED1  RGB_LED1206  [RGB]  (value not drawn)
LS1  Bell  [MLT-5020 BZ]
LS2  Bell  [BZ]
PCAM  Header 15  [MHDR1X15]
PMOD1  Header 6X2A  [SMT-HEADER 6*2]
PMOD2  Header 6X2A  [SMT-HEADER 6*2]
PMOD3  Header 6X2A  [SMT-HEADER 6*2]
PMOD4  Header 6X2A  [SMT-HEADER 6*2]
PMOD5  Header 6X2A  [SMT-HEADER 6*2]
PMOD6  Header 6X2A  [SMT-HEADER 6*2]
PMOD7  Header 6X2A  [SMT-HEADER 6*2]
PMOD8  Header 6X2A  [SMT-HEADER 6*2]
PMOD9  Header 6X2A  [SMT-HEADER 6*2]
Q1  SS8050 Y1  [SOT-23(SOT-23-3)]
Q2  SS8050 Y1  [SOT-23(SOT-23-3)]
R24  1.5KΩ (1501) ±1%  [0402_R]
R25  1.5KΩ (1501) ±1%  [0402_R]
R26  0Ω (0R0) ±1%  [0402_R]
R27  0Ω (0R0) ±1%  [0402_R]
R28  51Ω (51R0) ±1%  [0402_R]
R29  1KΩ (1001) ±1%  [0402_R]
R30  1KΩ (1001) ±1%  [0402_R]
R31  0Ω (0R0) ±1%  [0402_R]
R32  2KΩ (2001) ±1%  [0402_R]
R33  2KΩ (2001) ±1%  [0402_R]
R34  1KΩ (1001) ±1%  [0402_R]
R61  10Ω (10R0) ±1%  [0402_R]
Rp1  470Ω (471) ±5%  [0603_Rx4]
Rp2  470Ω (471) ±5%  [0603_Rx4]
Rp3  470Ω (471) ±5%  [0603_Rx4]
Rp4  470Ω (471) ±5%  [0603_Rx4]
Rp5  470Ω (471) ±5%  [0603_Rx4]
Rp6  470Ω (471) ±5%  [0603_Rx4]
S2  SW-PB  [key 3*4*2]
S3  SW-PB  [key 3*4*2]
S4  SW DIP-2  [sw*2]
S5  SW DIP-2  [sw*2]
SD*1  TF_card  [TF卡座(短体)]  (value not drawn)
U6  SPK0641  [SPK0641HT]
U7  SPK0641  [SPK0641HT]
USB1  USB_5line  [USB-MICRO-5P-2F]

### Ports
ANALOG[13..0] (harness Flexbus), BANK14_IO[42..1], BANK15_IO[9..1], PL_BZ, PL_KEY, PL_LED1, PL_LED2, PL_LED3, PL_SW1, PL_SW2, PMOD1 (harness PMOD), PMOD2 (harness PMOD), PMOD3 (harness PMOD), PMOD4 (harness PMOD), PS_BZ, PS_KEY, PS_LED1, PS_LED2, PS_SW1, PS_SW2, PTE[5..0], Shiel-B (harness ShielB), Shiel-C (harness ShielC), Shiel-D1 (harness ShielD1), Shiel-D2 (harness ShielD2), USB0D_N, USB0D_P

### Harnesses
ShielB: E8, E9, E10, E6, E7, E12, E11, E28
PMOD: 1, 2, 3, 4, 5, 6, 7, 8
ShielC: 1, 2, 3, 4, 5, 6, 7, 8, 9, 10, 11, 12, 13, 14, 15, 16
ShielD1: 1, 2, 3, 4, 5, 6, 7, 8
ShielD2: 1, 2, 3, 4, 5, 6, 7, 8, 9, 10, 11, 12

### Nets
3V3: C59.2 C60.2 C61.2 C62.2 C87.2 C88.2 C89.2 C90.2 C91.2 C92.2 C93.2 C94.2 C95.2 C96.2 C97.2 C98.2 C99.2 C100.2 C102.1 C103.1 HAT1.1(3.3V) HAT1.17(3.3V) PCAM.15 PMOD1.1 PMOD1.7 PMOD2.1 PMOD2.7 PMOD3.1 PMOD3.7 PMOD4.1 PMOD4.7 PMOD5.1 PMOD5.7 PMOD6.1 PMOD6.7 PMOD7.1 PMOD7.7 PMOD8.1 PMOD8.7 PMOD9.1 PMOD9.7 R28.2 R29.1 R61.2 SD*1.4(VDD) U6.3(SELECT) U6.4(VDD) U7.4(VDD)
5V0: F1.1
GND: C59.1 C60.1 C61.1 C62.1 C84.1 C86.1 C87.1 C88.1 C89.1 C90.1 C91.1 C92.1 C93.1 C94.1 C95.1 C96.1 C97.1 C98.1 C99.1 C100.1 C102.2 C103.2 HAT1.6(GND) HAT1.9(GND) HAT1.14(GND) HAT1.20(GND) HAT1.25(GND) HAT1.30(GND) HAT1.34(GND) HAT1.39(GND) PCAM.1 PCAM.4 PCAM.7 PCAM.10 PMOD1.2 PMOD1.8 PMOD2.2 PMOD2.8 PMOD3.2 PMOD3.8 PMOD4.2 PMOD4.8 PMOD5.2 PMOD5.8 PMOD6.2 PMOD6.8 PMOD7.2 PMOD7.8 PMOD8.2 PMOD8.8 PMOD9.2 PMOD9.8 Q1.2(E) Q2.2(E) R30.2 R31.2 R32.2 R33.2 R34.2 S3.2 SD*1.6(VSS) U6.5(GND) U6.6(GND) U6.7(GND) U6.8(GND) U7.3(SELECT) U7.5(GND) U7.6(GND) U7.7(GND) U7.8(GND) USB1.5(GND)
VBUS: C84.2 C86.2 F1.2 HAT1.2(5V) HAT1.4(5V) USB1.1(VBUS)
ANALOG1: PMOD5.6
ANALOG2: PMOD5.5
ANALOG3: PMOD5.10
ANALOG4: PMOD5.9
ANALOG5: PMOD5.4
ANALOG6: PMOD5.3
ANALOG7: PMOD4.12
ANALOG8: PMOD4.6
ANALOG9: PMOD5.11
ANALOG10: PMOD5.12
ANALOG11: PMOD4.11
ANALOG12: PMOD4.10
ANALOG13: PMOD4.9 ; port PMOD4.4
BANK14_IO1: S2.1 ; port PL_KEY
BANK14_IO2: LED1.3(R) ; port PL_LED3
BANK14_IO3: HAT1.5(SCL.1)
BANK14_IO4: LED1.1(B) ; port PL_LED1
BANK14_IO5: LED1.4(G) ; port PL_LED2
BANK14_IO6: R24.1 ; port PL_BZ
BANK14_IO7: HAT1.3(SDA.1)
BANK14_IO8: HAT1.7(GPIO.7)
BANK14_IO9: HAT1.12(GPIO.1)
BANK14_IO10: HAT1.11(GPIO.0)
BANK14_IO11: HAT1.15(GPIO.3)
BANK14_IO12: HAT1.13(GPIO.2)
BANK14_IO13: HAT1.18(GPIO.5)
BANK14_IO14: HAT1.16(GPIO.4)
BANK14_IO15: HAT1.10(RXD)
BANK14_IO16: HAT1.21(MISO)
BANK14_IO17: HAT1.8(TXD)
BANK14_IO18: HAT1.19(MOSI)
BANK14_IO19: HAT1.27(SDA.0)
BANK14_IO20: HAT1.31(GPIO.22)
BANK14_IO21: HAT1.28(SCL.0)
BANK14_IO22: HAT1.24(CE0)
BANK14_IO23: HAT1.26(CE1)
BANK14_IO24: HAT1.23(SCLK)
BANK14_IO25: HAT1.22(GPIO.6)
BANK14_IO26: HAT1.33(GPIO.23)
BANK14_IO27: HAT1.29(GPIO.21)
BANK14_IO28: HAT1.37(GPIO.25)
BANK14_IO29: HAT1.36(GPIO.27)
BANK14_IO30: Rp1.5 ; port PMOD1.1
BANK14_IO32: Rp2.8 ; port PMOD1.8
BANK14_IO33: HAT1.40(GPIO.29)
BANK14_IO34: Rp2.7 ; port PMOD1.7
BANK14_IO35: HAT1.38(GPIO.28)
BANK14_IO36: HAT1.35(GPIO.24)
BANK14_IO37: HAT1.32(GPIO.26)
BANK14_IO38: Rp1.7 ; port PMOD1.2
BANK14_IO39: Rp1.6 ; port PMOD1.3
BANK14_IO40: Rp2.5 ; port PMOD1.5
BANK14_IO41: Rp2.6 ; port PMOD1.6
BANK14_IO42: Rp1.8 ; port PMOD1.4
BANK34_IO1: U6.2(CLK) ; port Shiel-D2.12
BANK34_IO2: U6.1(DATA) ; port Shiel-D2.11
BANK34_IO3: Rp4.5 ; port PMOD2.5
BANK34_IO4: Rp5.6 ; port PMOD3.2
BANK34_IO5: Rp5.5 ; port PMOD3.1
BANK34_IO6: Rp6.5 ; port PMOD2.6
BANK34_IO7: Rp5.8 ; port PMOD3.4
BANK34_IO8: Rp5.7 ; port PMOD3.3
BANK34_IO9: Rp6.6 ; port PMOD3.5
BANK34_IO10: Rp4.6 ; port PMOD3.7
BANK34_IO11: Rp6.7 ; port PMOD3.6
BANK34_IO12: Rp4.7 ; port PMOD2.7
BANK34_IO13: S4.1(A1) ; port PL_SW1
BANK34_IO14: Rp3.5 ; port PMOD2.1
BANK34_IO15: Rp6.8 ; port PMOD3.8
BANK34_IO16: Rp3.7 ; port PMOD2.3
BANK34_IO17: Rp3.6 ; port PMOD2.2
BANK34_IO18: Rp4.8 ; port PMOD2.8
BANK34_IO19: Rp3.8 ; port PMOD2.4
BANK34_IO20: S4.2(A2) ; port PL_SW2
BANK35_IO7: PCAM.12 ; port Shiel-D2.7
BANK35_IO8: PCAM.11 ; port Shiel-D2.8
BANK35_IO9: PMOD9.4 U7.1(DATA) ; port Shiel-D2.9
BANK35_IO10: PMOD9.3 U7.2(CLK) ; port Shiel-D2.10
CAN0_RX: PMOD8.9 ; port Shiel-C.16
CAN0_TX: PMOD8.11 ; port Shiel-C.15
FTM1_QDA: PMOD7.9 ; port Shiel-C.1
FTM1_QDB: PMOD7.10 ; port Shiel-C.9
FTM2_QDA: PMOD7.6 ; port Shiel-C.2
FTM2_QDB: PMOD7.5 ; port Shiel-C.10
LPTMR0: PMOD7.4 ; port Shiel-C.11
MIPICLK_N: PCAM.8 ; port Shiel-D2.2
MIPICLK_P: PCAM.9 ; port Shiel-D2.1
MIPILANE0_N: PCAM.2 ; port Shiel-D2.4
MIPILANE0_P: PCAM.3 ; port Shiel-D2.3
MIPILANE1_N: PCAM.5 ; port Shiel-D2.6
MIPILANE1_P: PCAM.6 ; port Shiel-D2.5
PTA5: PMOD7.12 ; port Shiel-C.3
PTA6: S5.2(A2) ; port PS_SW1
PTA7: S5.1(A1) ; port PS_SW2
PTA14: PMOD7.11 ; port Shiel-C.4
PTA15: PMOD7.3 ; port Shiel-C.12
PTA16: PMOD8.12 ; port Shiel-C.6
PTA17: PMOD8.5 ; port Shiel-C.13
PTA24: PMOD8.6 ; port Shiel-C.5
PTA25: PMOD8.4 ; port Shiel-C.14
PTA26: PMOD8.3 ; port Shiel-C.7
PTA27: PMOD8.10 ; port Shiel-C.8
PTA28: PMOD9.6 ; port Shiel-D1.1
PTA29: PMOD9.5 ; port Shiel-D1.5
PTB0: PMOD9.12 ; port Shiel-D1.2
PTB1: PMOD9.11 ; port Shiel-D1.6
PTB2: PCAM.13 ; port Shiel-D1.3
PTB3: PCAM.14 ; port Shiel-D1.7
PTB4: PMOD9.10 ; port Shiel-D1.4
PTB5: PMOD9.9 ; port Shiel-D1.8
PTD8: L3.1(A) ; port PS_LED1
PTD9: L4.1(A) ; port PS_LED2
PTE0: SD*1.8(DAT1)
PTE1: SD*1.7(DAT0)
PTE2: SD*1.5(CLK)
PTE3: SD*1.3(CMD)
PTE4: SD*1.2(DTA3)
PTE5: SD*1.1(DTA2)
PTE6: PMOD6.6 ; port Shiel-B.E6
PTE7: PMOD6.12 ; port Shiel-B.E7
PTE8: PMOD6.11 ; port Shiel-B.E8
PTE9: PMOD6.5 ; port Shiel-B.E9
PTE10: PMOD6.4 ; port Shiel-B.E10
PTE11: PMOD6.10 ; port Shiel-B.E11
PTE12: PMOD6.9 ; port Shiel-B.E12
PTE24: PMOD4.5 ; port PMOD4.1
PTE25: PMOD4.4 ; port PMOD4.2
PTE26: R25.1 ; port PS_BZ
PTE27: S3.1 ; port PS_KEY
PTE28: PMOD6.3 ; port Shiel-B.E28
RTC_WAKE: PMOD4.3 ; port PMOD4.3  [project net PTE24]
USB0_N: R26.1 USB1.2(DM)
USB0_P: R27.1 USB1.3(DP)
USB0D_N: R26.2 ; port USB0D_N
USB0D_P: R27.2 ; port USB0D_P
NetD2_1: D2.1(A) LS1.2(B) Q1.3(C)
NetD2_2: D2.2(K) LS1.1(A) R28.1
NetD3_1: D3.1(A) LS2.2(B) Q2.3(C)
NetD3_2: D3.2(K) LS2.1(A) R61.1
NetL3_2: L3.2(K) R32.1
NetL4_2: L4.2(K) R33.1
NetLED1_2: LED1.2(+) R29.2
NetPMOD1_3: PMOD1.3 Rp2.1
NetPMOD1_4: PMOD1.4 Rp2.2
NetPMOD1_5: PMOD1.5 Rp2.3
NetPMOD1_6: PMOD1.6 Rp2.4
NetPMOD1_9: PMOD1.9 Rp1.1
NetPMOD1_10: PMOD1.10 Rp1.2
NetPMOD1_11: PMOD1.11 Rp1.3
NetPMOD1_12: PMOD1.12 Rp1.4
NetPMOD2_3: PMOD2.3 Rp4.1
NetPMOD2_4: PMOD2.4 Rp4.2
NetPMOD2_5: PMOD2.5 Rp4.3
NetPMOD2_6: PMOD2.6 Rp4.4
NetPMOD2_9: PMOD2.9 Rp3.1
NetPMOD2_10: PMOD2.10 Rp3.2
NetPMOD2_11: PMOD2.11 Rp3.3
NetPMOD2_12: PMOD2.12 Rp3.4
NetPMOD3_3: PMOD3.3 Rp6.1
NetPMOD3_4: PMOD3.4 Rp6.2
NetPMOD3_5: PMOD3.5 Rp6.3
NetPMOD3_6: PMOD3.6 Rp6.4
NetPMOD3_9: PMOD3.9 Rp5.1
NetPMOD3_10: PMOD3.10 Rp5.2
NetPMOD3_11: PMOD3.11 Rp5.3
NetPMOD3_12: PMOD3.12 Rp5.4
NetQ1_1: Q1.1(B) R24.2
NetQ2_1: Q2.1(B) R25.2
NetR30_1: R30.1 S4.3(B2) S4.4(B1)
NetR31_1: R31.1 S5.3(B2) S5.4(B1)
NetR34_1: R34.1 S2.2

Not connected (* = marked no-connect by the designer): SD*1 9(CD_SW)* 10* 11* 12* 13*; USB1 0(Shield) 4(ID)

### Buses and harness runs
bus ANALOG[13..0]
bus BANK14_IO[42..1] = port BANK14_IO[42..1]
bus BANK15_IO[9..1] = port BANK15_IO[9..1]
bus PTE[5..0] = port PTE[5..0]

### Layout directives
differential pair: MIPICLK_N, MIPICLK_P, MIPILANE0_N, MIPILANE0_P, MIPILANE1_N, MIPILANE1_P, USB0_N, USB0_P, USB0D_N, USB0D_P

### Notes on the sheet
- (in symbol TF_card) SD_card

### Library data of the parts
C59-C62 C87-C91 = Cap: 贴片电容; Published: 8-Jun-2000; LatestRevisionDate: 17-Jul-2002; LatestRevisionNote: Re-released for DXP Platform.; PackageReference: RAD-0.3; Publisher: Altium Limited
C84 = 0603 10uF (106) 10% 10V: 贴片电容; ComponentLink1Description: 供应商链接; ComponentLink1URL: http://www.szlcsc.com/product/details_20411.html; Package: 0603; Supplier: LC; SuppliersPartNumber: C19702
C86 = 0402 10nF (103) 10% 50V: 贴片电容; ComponentLink1Description: 供应商链接; ComponentLink1URL: http://www.szlcsc.com/product/details_15869.html; Package: 0402; Supplier: LC; SuppliersPartNumber: C15195
C92 C93 C96-C98 C103 = 0402 100nF (104) 10% 16V: 贴片电容; ComponentLink1Description: 供应商链接; ComponentLink1URL: http://www.szlcsc.com/product/details_1877.html; Package: 0402; Supplier: LC; SuppliersPartNumber: C1525
C94 C95 C99 C100 = 0402 10uF (106) 20% 6.3V: 贴片电容; ComponentLink1Description: 供应商链接; ComponentLink1URL: http://www.szlcsc.com/product/details_16204.html; Package: 0402; Supplier: LC; SuppliersPartNumber: C15525
C102 = 0603 22uF (226) 20% 6.3V: 贴片电容; ComponentLink1Description: 供应商链接; ComponentLink1URL: http://www.szlcsc.com/product/details_60514.html; Package: 0603; Supplier: LC; SuppliersPartNumber: C59461
D2 D3 = SMA(DO-214AC) SS54: 二极管; ComponentLink1Description: 供应商链接; ComponentLink1URL: http://www.szlcsc.com/product/details_23178.html; Package: SMA(DO-214AC); Supplier: LC; SuppliersPartNumber: C22452
F1 = Fuse 1: Fuse; Published: 8-Jun-2000; LatestRevisionDate: 17-Jul-2002; LatestRevisionNote: Re-released for DXP Platform.; PackageReference: PIN-W2/E2.8; Publisher: Altium Limited; PackageDescription: Thru-Hole; 2 Leads
LS1 LS2 = Bell: Electrical Bell; Published: 24-Mar-1999; LatestRevisionDate: 17-Jul-2002; LatestRevisionNote: Re-released for DXP Platform.; PackageReference: PIN2; Publisher: Altium Limited
PCAM = Header 15: Header, 15-Pin; LatestRevisionDate: 17-Jul-2002; LatestRevisionNote: Re-released for DXP Platform.; Publisher: Altium Limited
PMOD1-PMOD9 = Header 6X2A: Header, 6-Pin, Dual row; LatestRevisionDate: 17-Jul-2002; LatestRevisionNote: Re-released for DXP Platform.; Publisher: Altium Limited
Q1 Q2 = SOT-23 SS8050 Y1: 三极管; ComponentLink1Description: 供应商链接; ComponentLink1URL: http://www.szlcsc.com/product/details_2507.html; Package: SOT-23; Supplier: LC; SuppliersPartNumber: C2150
R24 R25 = 0402 1.5KΩ (1501) 1%: 贴片电阻; ComponentLink1Description: 供应商链接; ComponentLink1URL: http://www.szlcsc.com/product/details_26610.html; Package: 0402; Supplier: LC; SuppliersPartNumber: C25867
R26 R27 R31 = 0402 0Ω (0R0) 1%: 贴片电阻; ComponentLink1Description: 供应商链接; ComponentLink1URL: http://www.szlcsc.com/product/details_17853.html; Package: 0402; Supplier: LC; SuppliersPartNumber: C17168
R28 = 0402 51Ω (51R0) 1%: 贴片电阻; ComponentLink1Description: 供应商链接; ComponentLink1URL: http://www.szlcsc.com/product/details_25868.html; Package: 0402; Supplier: LC; SuppliersPartNumber: C25125
R29 R30 R34 = 0402 1KΩ (1001) 1%: 贴片电阻; ComponentLink1Description: 供应商链接; ComponentLink1URL: http://www.szlcsc.com/product/details_12256.html; Package: 0402; Supplier: LC; SuppliersPartNumber: C11702
R32 R33 = 0402 2KΩ (2001) 1%: 贴片电阻; ComponentLink1Description: 供应商链接; ComponentLink1URL: http://www.szlcsc.com/product/details_4516.html; Package: 0402; Supplier: LC; SuppliersPartNumber: C4109
R61 = 0402 10Ω (10R0) 1%: 贴片电阻; ComponentLink1Description: 供应商链接; ComponentLink1URL: http://www.szlcsc.com/product/details_25820.html; Package: 0402; Supplier: LC; SuppliersPartNumber: C25077
Rp1-Rp6 = 0603*4 470Ω (471) 5%: 贴片排阻; ComponentLink1Description: 供应商链接; ComponentLink1URL: http://www.szlcsc.com/product/details_26253.html; Package: 0603*4; Supplier: LC; SuppliersPartNumber: C25510
S2 S3 = SW-PB: Switch
  S2: Published: 24-Mar-1999; LatestRevisionDate: 17-Jul-2002; LatestRevisionNote: Re-released for DXP Platform.; PackageReference: SPST-2; Publisher: Altium Limited; PackageDescription: Switch; 2 Leads
S4 S5 = SW DIP-2: DIP Switch, 2 Position, SPST; Published: 24-Mar-1999; LatestRevisionDate: 17-Jul-2002; LatestRevisionNote: Re-released for DXP Platform.; PackageReference: DIP-4; Publisher: Altium Limited

## Sheet MEMORY.SchDoc
size A4
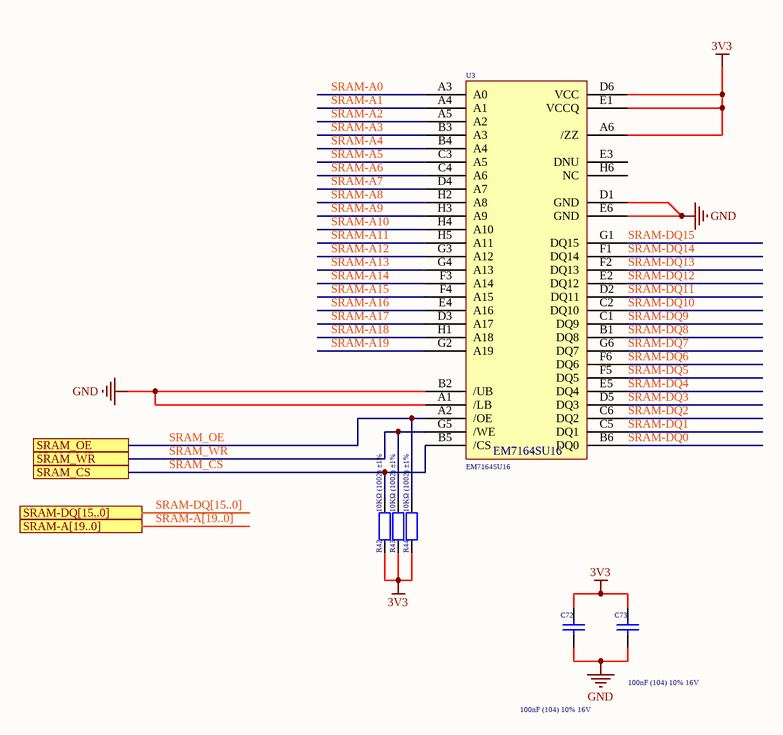
[diagram p4: MEMORY.SchDoc]

### Parts
C72  100nF (104) 10% 16V  [0402_C]
C73  100nF (104) 10% 16V  [0402_C]
R42  10KΩ (1002) ±1%  [0402_R]
R43  10KΩ (1002) ±1%  [0402_R]
R44  10KΩ (1002) ±1%  [0402_R]
U3  EM7164SU16  [BGA48C75P6X8_598X698X104]

### Ports
SRAM-A[19..0], SRAM-DQ[15..0], SRAM_CS, SRAM_OE, SRAM_WR

### Nets
3V3: C72.2 C73.2 R42.1 R43.1 R44.1 U3.A6(/ZZ) U3.D6(VCC) U3.E1(VCCQ)
GND: C72.1 C73.1 U3.A1(/LB) U3.B2(/UB) U3.D1(GND) U3.E6(GND)
SRAM-A0: U3.A3(A0)
SRAM-A1: U3.A4(A1)
SRAM-A2: U3.A5(A2)
SRAM-A3: U3.B3(A3)
SRAM-A4: U3.B4(A4)
SRAM-A5: U3.C3(A5)
SRAM-A6: U3.C4(A6)
SRAM-A7: U3.D4(A7)
SRAM-A8: U3.H2(A8)
SRAM-A9: U3.H3(A9)
SRAM-A10: U3.H4(A10)
SRAM-A11: U3.H5(A11)
SRAM-A12: U3.G3(A12)
SRAM-A13: U3.G4(A13)
SRAM-A14: U3.F3(A14)
SRAM-A15: U3.F4(A15)
SRAM-A16: U3.E4(A16)
SRAM-A17: U3.D3(A17)
SRAM-A18: U3.H1(A18)
SRAM-A19: U3.G2(A19)
SRAM-DQ0: U3.B6(DQ0)
SRAM-DQ1: U3.C5(DQ1)
SRAM-DQ2: U3.C6(DQ2)
SRAM-DQ3: U3.D5(DQ3)
SRAM-DQ4: U3.E5(DQ4)
SRAM-DQ5: U3.F5(DQ5)
SRAM-DQ6: U3.F6(DQ6)
SRAM-DQ7: U3.G6(DQ7)
SRAM-DQ8: U3.B1(DQ8)
SRAM-DQ9: U3.C1(DQ9)
SRAM-DQ10: U3.C2(DQ10)
SRAM-DQ11: U3.D2(DQ11)
SRAM-DQ12: U3.E2(DQ12)
SRAM-DQ13: U3.F2(DQ13)
SRAM-DQ14: U3.F1(DQ14)
SRAM-DQ15: U3.G1(DQ15)
SRAM_CS: R42.2 U3.B5(/CS) ; port SRAM_CS
SRAM_OE: R44.2 U3.A2(/OE) ; port SRAM_OE
SRAM_WR: R43.2 U3.G5(/WE) ; port SRAM_WR

Not connected (* = marked no-connect by the designer): U3 E3(DNU) H6(NC)

### Buses and harness runs
bus SRAM-A[19..0] = port SRAM-A[19..0]
bus SRAM-DQ[15..0] = port SRAM-DQ[15..0]

### Library data of the parts
C72 C73 = 0402 100nF (104) 10% 16V: 贴片电容; ComponentLink1Description: 供应商链接; ComponentLink1URL: http://www.szlcsc.com/product/details_1877.html; Package: 0402; Supplier: LC; SuppliersPartNumber: C1525
R42-R44 = 0402 10KΩ (1002) 1%: 贴片电阻; ComponentLink1Description: 供应商链接; ComponentLink1URL: http://www.szlcsc.com/product/details_26487.html; Package: 0402; Supplier: LC; SuppliersPartNumber: C25744

## Sheet FPGA_CONFIG.SchDoc
size A4
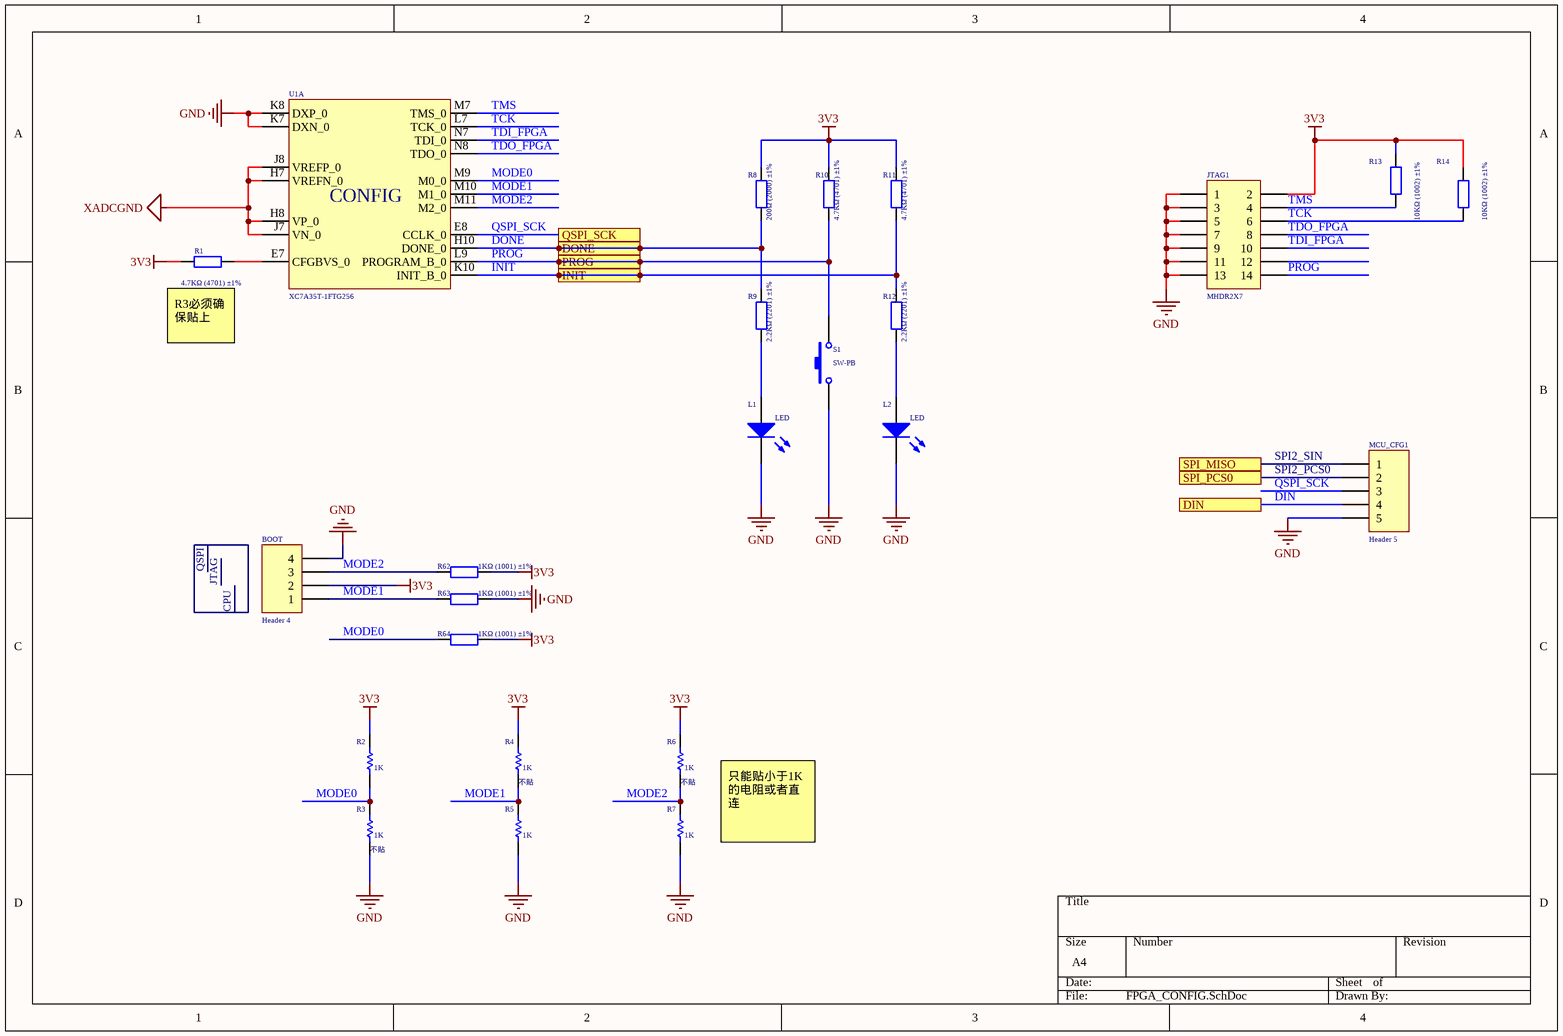
[diagram p5: FPGA_CONFIG.SchDoc]

### Parts
BOOT  Header 4  [HDR1X4]
JTAG1  MHDR2X7  [SMT7*2-2MM]
L1  LED  [1608[0603]]
L2  LED  [1608[0603]]
MCU_CFG1  Header 5  [MHDR1X5]
R1  4.7KΩ (4701) ±1%  [0402_R]
R2  value 1K  [1608[0603]]  (hidden comment: Res)
R3  不贴  value 1K  [1608[0603]]
R4  不贴  value 1K  [1608[0603]]
R5  value 1K  [1608[0603]]  (hidden comment: Res)
R6  不贴  value 1K  [1608[0603]]
R7  value 1K  [1608[0603]]  (hidden comment: Res)
R8  200Ω (2000) ±1%  [0402_R]
R9  2.2KΩ (2201) ±1%  [0402_R]
R10  4.7KΩ (4701) ±1%  [0402_R]
R11  4.7KΩ (4701) ±1%  [0402_R]
R12  2.2KΩ (2201) ±1%  [0402_R]
R13  10KΩ (1002) ±1%  [0402_R]
R14  10KΩ (1002) ±1%  [0402_R]
R62  1KΩ (1001) ±1%  [0402_R]
R63  1KΩ (1001) ±1%  [0402_R]
R64  1KΩ (1001) ±1%  [0402_R]
S1  SW-PB  [key 3*4*2]
U1  XC7A35T-1FTG256  [BGA100P9X9-81A]  (part A of 7)

### Ports
DIN, DONE, INIT, PROG, QSPI_SCK, SPI_MISO, SPI_PCS0

### Nets
3V3: BOOT.2 JTAG1.2 R1.1 R2.2 R4.2 R6.2 R8.2 R10.2 R11.2 R13.2 R14.2 R62.2 R64.2
GND: BOOT.4 JTAG1.1 JTAG1.3 JTAG1.5 JTAG1.7 JTAG1.9 JTAG1.11 JTAG1.13 L1.2(K) L2.2(K) MCU_CFG1.5 R3.1 R5.1 R7.1 R63.2 S1.1 U1.K7(DXN_0) U1.K8(DXP_0)
XADCGND: U1.H7(VREFN_0) U1.H8(VP_0) U1.J7(VN_0) U1.J8(VREFP_0)
DIN: MCU_CFG1.4 ; port DIN
DONE: R8.1 R9.2 U1.H10(DONE_0) ; port DONE
INIT: R11.1 R12.2 U1.K10(INIT_B_0) ; port INIT  [project net FPGA_INIT]
MODE0: R2.1 R3.2 R64.1 U1.M9(M0_0)
MODE1: BOOT.1 R4.1 R5.2 R63.1 U1.M10(M1_0)
MODE2: BOOT.3 R6.1 R7.2 R62.1 U1.M11(M2_0)
PROG: JTAG1.14 R10.1 S1.2 U1.L9(PROGRAM_B_0) ; port PROG
QSPI_SCK: MCU_CFG1.3 U1.E8(CCLK_0) ; port QSPI_SCK
SPI2_PCS0: MCU_CFG1.2 ; port SPI_PCS0
SPI2_SIN: MCU_CFG1.1 ; port SPI_MISO
TCK: JTAG1.6 R14.1 U1.L7(TCK_0)
TDI_FPGA: JTAG1.10 U1.N7(TDI_0)
TDO_FPGA: JTAG1.8 U1.N8(TDO_0)
TMS: JTAG1.4 R13.1 U1.M7(TMS_0)
NetL1_1: L1.1(A) R9.1
NetL2_1: L2.1(A) R12.1
NetR1_2: R1.2 U1.E7(CFGBVS_0)

Not connected (* = marked no-connect by the designer): JTAG1 12

### Notes on the sheet
- (near R1) R3必须确保贴上
- QSPI
- JTAG
- CPU
- 只能贴小于1K的电阻或者直连
- (in symbol XC7A35T-1FTG256, part A) CONFIG

### Library data of the parts
BOOT = Header 4: Header, 4-Pin; LatestRevisionDate: 17-Jul-2002; LatestRevisionNote: Re-released for DXP Platform.; Publisher: Altium Limited
JTAG1 = MHDR2X7: Header, 7-Pin, Dual row; LatestRevisionDate: 17-Jul-2002; LatestRevisionNote: Re-released for DXP Platform.; Publisher: Altium Limited
MCU_CFG1 = Header 5: Header, 5-Pin; LatestRevisionDate: 17-Jul-2002; LatestRevisionNote: Re-released for DXP Platform.; Publisher: Altium Limited
R1 R10 R11 = 0402 4.7KΩ (4701) 1%: 贴片电阻; ComponentLink1Description: 供应商链接; ComponentLink1URL: http://www.szlcsc.com/product/details_26643.html; Package: 0402; Supplier: LC; SuppliersPartNumber: C25900
R2-R7 = Res: 贴片电阻; Published: 8-Jun-2000; LatestRevisionDate: 17-Jul-2002; LatestRevisionNote: Re-released for DXP Platform.; PackageReference: AXIAL-0.3; Publisher: Altium Limited
R8 = 0402 200Ω (2000) 1%: 贴片电阻; ComponentLink1Description: 供应商链接; ComponentLink1URL: http://www.szlcsc.com/product/details_25830.html; Package: 0402; Supplier: LC; SuppliersPartNumber: C25087
R9 R12 = 0402 2.2KΩ (2201) 1%: 贴片电阻; ComponentLink1Description: 供应商链接; ComponentLink1URL: http://www.szlcsc.com/product/details_26622.html; Package: 0402; Supplier: LC; SuppliersPartNumber: C25879
R13 R14 = 0402 10KΩ (1002) 1%: 贴片电阻; ComponentLink1Description: 供应商链接; ComponentLink1URL: http://www.szlcsc.com/product/details_26487.html; Package: 0402; Supplier: LC; SuppliersPartNumber: C25744
R62-R64 = 0402 1KΩ (1001) 1%: 贴片电阻; ComponentLink1Description: 供应商链接; ComponentLink1URL: http://www.szlcsc.com/product/details_12256.html; Package: 0402; Supplier: LC; SuppliersPartNumber: C11702
S1 = SW-PB: Switch; Published: 24-Mar-1999; LatestRevisionDate: 17-Jul-2002; LatestRevisionNote: Re-released for DXP Platform.; PackageReference: SPST-2; Publisher: Altium Limited; PackageDescription: Switch; 2 Leads

## Sheet FPGA_POWER.SchDoc
size A4
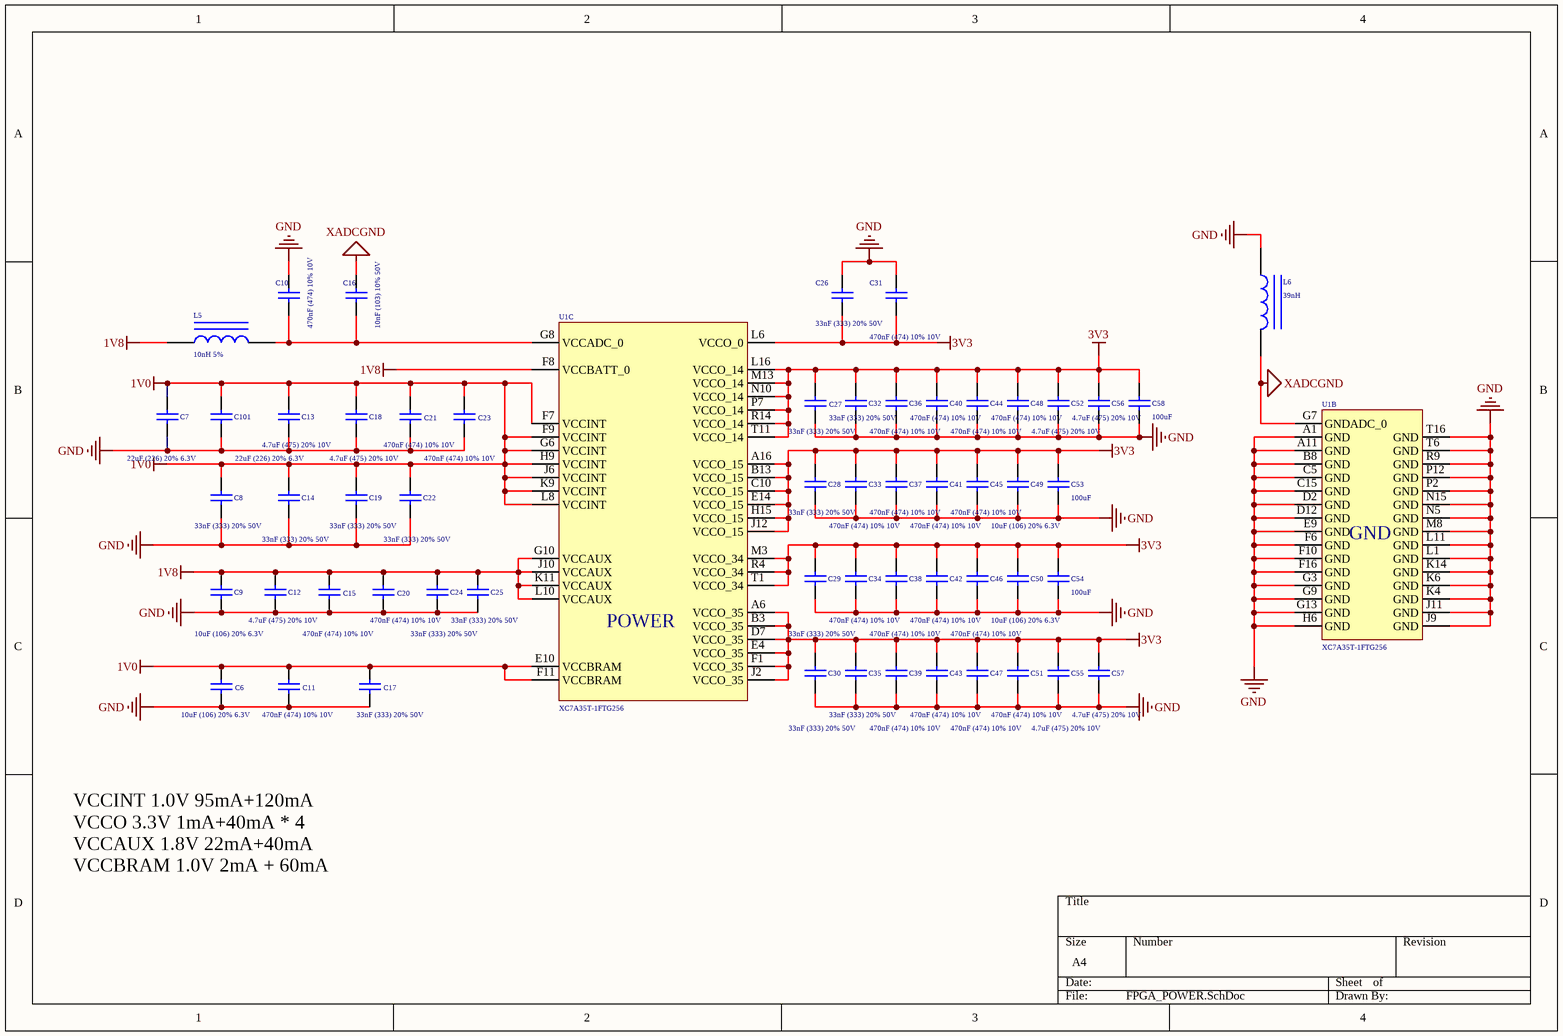
[diagram p6: FPGA_POWER.SchDoc]

### Parts
C6  10uF (106) 20% 6.3V  [0402_C]
C7  22uF (226) 20% 6.3V  [0603_C]
C8  33nF (333) 20% 50V  [0402_C]
C9  10uF (106) 20% 6.3V  [0402_C]
C10  470nF (474) 10% 10V  [0402_C]
C11  470nF (474) 10% 10V  [0402_C]
C12  4.7uF (475) 20% 10V  [0402_C]
C13  4.7uF (475) 20% 10V  [0402_C]
C14  33nF (333) 20% 50V  [0402_C]
C15  470nF (474) 10% 10V  [0402_C]
C16  10nF (103) 10% 50V  [0402_C]
C17  33nF (333) 20% 50V  [0402_C]
C18  4.7uF (475) 20% 10V  [0402_C]
C19  33nF (333) 20% 50V  [0402_C]
C20  470nF (474) 10% 10V  [0402_C]
C21  470nF (474) 10% 10V  [0402_C]
C22  33nF (333) 20% 50V  [0402_C]
C23  470nF (474) 10% 10V  [0402_C]
C24  33nF (333) 20% 50V  [0402_C]
C25  33nF (333) 20% 50V  [0402_C]
C26  33nF (333) 20% 50V  [0402_C]
C27  33nF (333) 20% 50V  [0402_C]
C28  33nF (333) 20% 50V  [0402_C]
C29  33nF (333) 20% 50V  [0402_C]
C30  33nF (333) 20% 50V  [0402_C]
C31  470nF (474) 10% 10V  [0402_C]
C32  33nF (333) 20% 50V  [0402_C]
C33  470nF (474) 10% 10V  [0402_C]
C34  470nF (474) 10% 10V  [0402_C]
C35  33nF (333) 20% 50V  [0402_C]
C36  470nF (474) 10% 10V  [0402_C]
C37  470nF (474) 10% 10V  [0402_C]
C38  470nF (474) 10% 10V  [0402_C]
C39  470nF (474) 10% 10V  [0402_C]
C40  470nF (474) 10% 10V  [0402_C]
C41  470nF (474) 10% 10V  [0402_C]
C42  470nF (474) 10% 10V  [0402_C]
C43  470nF (474) 10% 10V  [0402_C]
C44  470nF (474) 10% 10V  [0402_C]
C45  470nF (474) 10% 10V  [0402_C]
C46  470nF (474) 10% 10V  [0402_C]
C47  470nF (474) 10% 10V  [0402_C]
C48  470nF (474) 10% 10V  [0402_C]
C49  10uF (106) 20% 6.3V  [0402_C]
C50  10uF (106) 20% 6.3V  [0402_C]
C51  470nF (474) 10% 10V  [0402_C]
C52  4.7uF (475) 20% 10V  [0402_C]
C53  value 100uF  [LC-1206]  (hidden comment: Cap)
C54  value 100uF  [LC-1206]  (hidden comment: Cap)
C55  4.7uF (475) 20% 10V  [0402_C]
C56  4.7uF (475) 20% 10V  [0402_C]
C57  4.7uF (475) 20% 10V  [0402_C]
C58  value 100uF  [LC-1206]  (hidden comment: Cap)
C101  22uF (226) 20% 6.3V  [0603_C]
L5  10nH 5%  [0402_L]
L6  39nH  [0402_L]
U1  XC7A35T-1FTG256  [BGA100P9X9-81A]  (parts B,C of 7)

### Nets
1V0: C6.2 C7.2 C8.2 C11.2 C13.2 C14.2 C17.2 C18.2 C19.2 C21.2 C22.2 C23.2 C101.2 U1.E10(VCCBRAM) U1.F7(VCCINT) U1.F9(VCCINT) U1.F11(VCCBRAM) U1.G6(VCCINT) U1.H9(VCCINT) U1.J6(VCCINT) U1.K9(VCCINT) U1.L8(VCCINT)
1V8: C9.2 C12.2 C15.2 C20.2 C24.2 C25.2 L5.1 U1.F8(VCCBATT_0) U1.G10(VCCAUX) U1.J10(VCCAUX) U1.K11(VCCAUX) U1.L10(VCCAUX)
3V3: C26.1 C27.2 C28.2 C29.2 C30.2 C31.1 C32.2 C33.2 C34.2 C35.2 C36.2 C37.2 C38.2 C39.2 C40.2 C41.2 C42.2 C43.2 C44.2 C45.2 C46.2 C47.2 C48.2 C49.2 C50.2 C51.2 C52.2 C53.2 C54.2 C55.2 C56.2 C57.2 C58.2 U1.A6(VCCO_35) U1.A16(VCCO_15) U1.B3(VCCO_35) U1.B13(VCCO_15) U1.C10(VCCO_15) U1.D7(VCCO_35) U1.E4(VCCO_35) U1.E14(VCCO_15) U1.F1(VCCO_35) U1.H15(VCCO_15) U1.J2(VCCO_35) U1.J12(VCCO_15) U1.L6(VCCO_0) U1.L16(VCCO_14) U1.M3(VCCO_34) U1.M13(VCCO_14) U1.N10(VCCO_14) U1.P7(VCCO_14) U1.R4(VCCO_34) U1.R14(VCCO_14) U1.T1(VCCO_34) U1.T11(VCCO_14)
GND: C6.1 C7.1 C8.1 C9.1 C10.2 C11.1 C12.1 C13.1 C14.1 C15.1 C17.1 C18.1 C19.1 C20.1 C21.1 C22.1 C23.1 C24.1 C25.1 C26.2 C27.1 C28.1 C29.1 C30.1 C31.2 C32.1 C33.1 C34.1 C35.1 C36.1 C37.1 C38.1 C39.1 C40.1 C41.1 C42.1 C43.1 C44.1 C45.1 C46.1 C47.1 C48.1 C49.1 C50.1 C51.1 C52.1 C53.1 C54.1 C55.1 C56.1 C57.1 C58.1 C101.1 L6.1 U1.A1(GND) U1.A11(GND) U1.B8(GND) U1.C5(GND) U1.C15(GND) U1.D2(GND) U1.D12(GND) U1.E9(GND) U1.F6(GND) U1.F10(GND) U1.F16(GND) U1.G3(GND) U1.G9(GND) U1.G13(GND) U1.H6(GND) U1.J9(GND) U1.J11(GND) U1.K4(GND) U1.K6(GND) U1.K14(GND) U1.L1(GND) U1.L11(GND) U1.M8(GND) U1.N5(GND) U1.N15(GND) U1.P2(GND) U1.P12(GND) U1.R9(GND) U1.T6(GND) U1.T16(GND)
XADCGND: C16.2 L6.2 U1.G7(GNDADC_0)
NetC10_1: C10.1 C16.1 L5.2 U1.G8(VCCADC_0)

### Notes on the sheet
- VCCINT 1.0V 95mA+120mA
  VCCO 3.3V 1mA+40mA * 4
  VCCAUX 1.8V 22mA+40mA
  VCCBRAM 1.0V 2mA + 60mA
- (in symbol XC7A35T-1FTG256, part C) POWER

### Library data of the parts
C6 C9 C49 C50 = 0402 10uF (106) 20% 6.3V: 贴片电容; ComponentLink1Description: 供应商链接; ComponentLink1URL: http://www.szlcsc.com/product/details_16204.html; Package: 0402; Supplier: LC; SuppliersPartNumber: C15525
C7 C101 = 0603 22uF (226) 20% 6.3V: 贴片电容; ComponentLink1Description: 供应商链接; ComponentLink1URL: http://www.szlcsc.com/product/details_60514.html; Package: 0603; Supplier: LC; SuppliersPartNumber: C59461
C8 C14 C17 C19 C22 C24-C30 C32 C35 = 0402 33nF (333) 20% 50V: 贴片电容; ComponentLink1Description: 供应商链接; ComponentLink1URL: http://www.szlcsc.com/product/details_1937.html; Package: 0402; Supplier: LC; SuppliersPartNumber: C1585
C10 C11 C15 C20 C21 C23 C31 C33 C34 C36-C48 C51 = 0402 470nF (474) 10% 10V: 贴片电容; ComponentLink1Description: 供应商链接; ComponentLink1URL: http://www.szlcsc.com/product/details_48344.html; Package: 0402; Supplier: LC; SuppliersPartNumber: C47339
C12 C13 C18 C52 C55-C57 = 0402 4.7uF (475) 20% 10V: 贴片电容; ComponentLink1Description: 供应商链接; ComponentLink1URL: http://www.szlcsc.com/product/details_24469.html; Package: 0402; Supplier: LC; SuppliersPartNumber: C23733
C16 = 0402 10nF (103) 10% 50V: 贴片电容; ComponentLink1Description: 供应商链接; ComponentLink1URL: http://www.szlcsc.com/product/details_15869.html; Package: 0402; Supplier: LC; SuppliersPartNumber: C15195
C53 C54 C58 = Cap: 贴片电容; Published: 8-Jun-2000; LatestRevisionDate: 17-Jul-2002; LatestRevisionNote: Re-released for DXP Platform.; PackageReference: RAD-0.3; Publisher: Altium Limited
L5 = 0402 10nH 5%: 贴片电感; ComponentLink1Description: 供应商链接; ComponentLink1URL: http://www.szlcsc.com/product/details_27896.html; Package: 0402; Supplier: LC; SuppliersPartNumber: C27147
L6 = 0402 39nH: 贴片电感; ComponentLink1Description: 供应商链接; ComponentLink1URL: http://www.szlcsc.com/product/details_27187.html; Package: 0402; Supplier: LC; SuppliersPartNumber: C26443